# EAGLE design i2c_encoder_6 (EAGLE 9.3.0)

## Sheet 1 of 8
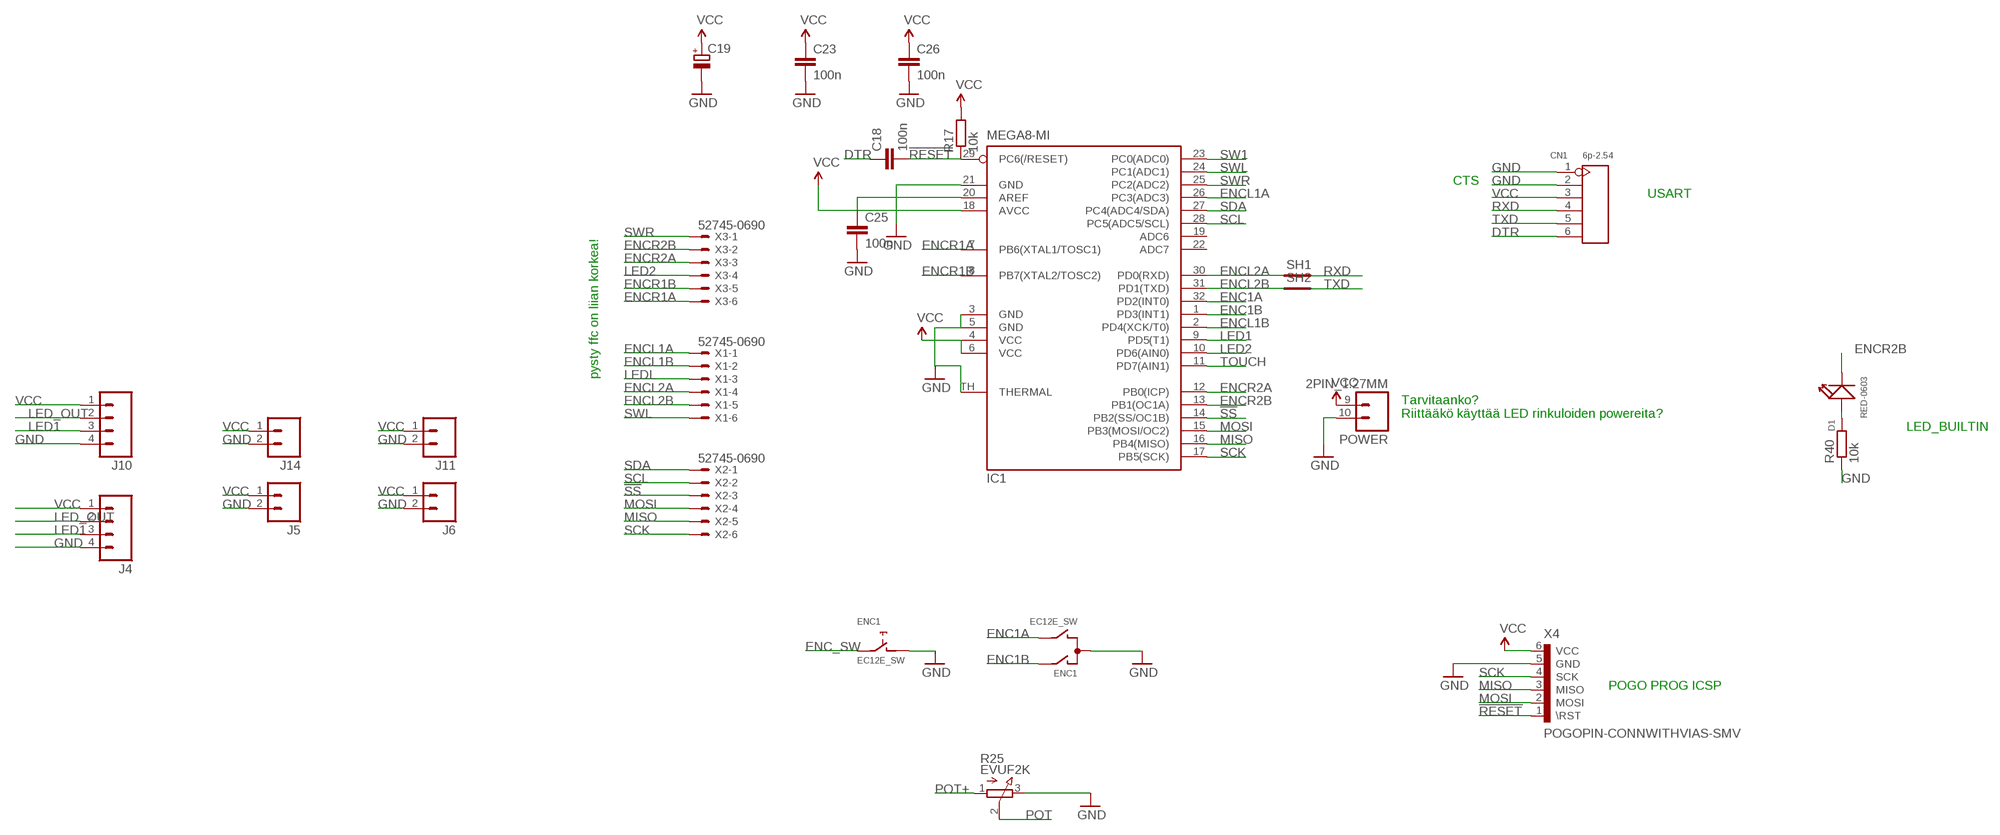
[diagram p0: schematic, sheet 1]

### Parts
C18  100n  CAP0603-CAP  [0603-CAP]
C19  CPOL-EUC  [PANASONIC_C]
C23  100n  CAP0603-CAP  [0603-CAP]
C25  100n  CAP0603-CAP  [0603-CAP]
C26  100n  CAP0603-CAP  [0603-CAP]
CN1  6p-2.54  DIP-BLACK-FEMALE-HEADER-VERT(6P-2.54)  [H6-2.54]
D1  RED-0603  LED-SMD-RED-DIFFUSED(0603)  [LED-0603]
ENC1  EC12E_SW  [ALPS_EC12E_SW]
IC1  MEGA8-MI  [MLF32-TH]
J4  M04NO_SILK_ALL_ROUND  [1X04_NO_SILK_ALL_ROUND]
J5  M021X02_NO_SILK  [1X02_NO_SILK]
J6  M021X02_NO_SILK  [1X02_NO_SILK]
J10  M04NO_SILK_ALL_ROUND  [1X04_NO_SILK_ALL_ROUND]
J11  M021X02_NO_SILK  [1X02_NO_SILK]
J14  M021X02_NO_SILK  [1X02_NO_SILK]
POWER  2PIN_1.27MM  [1X02_1.27MM_NO_SILK]
R17  10k  R-EU_R0603  [R0603]
R25  EVUF2K  [EVUFXK]
R40  10k  R-EU_R0603  [R0603]
SH1  SHORT  [SHORT_TOP_8MIL]
SH2  SHORT  [SHORT_TOP_8MIL]
X1  52745-0690  [52745-0690]
X2  52745-0690  [52745-0690]
X3  52745-0690  [52745-0690]
X4  POGOPIN-CONNWITHVIAS-SMV  [POGOPROG-CONN-OH-SMALLERVIAS]

### Nets
!RESET: C18.2 IC1.29(PC6(/RESET)) R17.1 X4.1(\RST)
!SS: IC1.14(PB2(SS/OC1B)) X2.3 ; also sheet 7
AREF: C25.1 IC1.20(AREF)
DTR: C18.1 CN1.6
ENC1A: ENC1.B IC1.32(PD2(INT0)) ; also sheet 4,8
ENC1B: ENC1.A IC1.1(PD3(INT1)) ; also sheet 4,8
ENC_SW: ENC1.E ; also sheet 4,8
ENCL1A: IC1.26(PC3(ADC3)) X1.1 ; also sheet 4
ENCL1B: IC1.2(PD4(XCK/T0)) X1.2 ; also sheet 4
ENCL2A: IC1.30(PD0(RXD)) SH1.P$1 X1.4 ; also sheet 4
ENCL2B: IC1.31(PD1(TXD)) SH2.P$1 X1.5 ; also sheet 4
ENCR1A: IC1.7(PB6(XTAL1/TOSC1)) X3.6 ; also sheet 4
ENCR1B: IC1.8(PB7(XTAL2/TOSC2)) X3.5 ; also sheet 4
ENCR2A: IC1.12(PB0(ICP)) X3.3 ; also sheet 4
ENCR2B: D1.- IC1.13(PB1(OC1A)) X3.2 ; also sheet 4
GND: C19.- C23.2 C25.2 C26.2 CN1.1 CN1.2 ENC1.C ENC1.D IC1.3(GND) IC1.5(GND) IC1.21(GND) IC1.TH(THERMAL) J4.4 J5.2 J6.2 J10.4 J11.2 J14.2 POWER.10 R25.3(E) R40.1 X4.5(GND) ; also sheet 2,3,5,6,7,8
LED1: IC1.9(PD5(T1)) J4.3 J10.3 ; also sheet 4,5,6,8
LED2: IC1.10(PD6(AIN0)) X3.4 ; also sheet 4
LED_OUT: J4.2 J10.2 ; also sheet 4,5,6,8
LEDL: X1.3 ; also sheet 4
MISO: IC1.16(PB4(MISO)) X2.5 X4.3(MISO) ; also sheet 2,7
MOSI: IC1.15(PB3(MOSI/OC2)) X2.4 X4.2(MOSI) ; also sheet 2,7
N$31: D1.+ R40.2
POT: R25.2(S) ; also sheet 4,8
POT+: R25.1(A) ; also sheet 4
RXD: CN1.4 SH1.P$2
SCK: IC1.17(PB5(SCK)) X2.6 X4.4(SCK) ; also sheet 2,7
SCL: IC1.28(PC5(ADC5/SCL)) X2.2 ; also sheet 7
SDA: IC1.27(PC4(ADC4/SDA)) X2.1 ; also sheet 7
SW1: IC1.23(PC0(ADC0)) ; also sheet 4
SWL: IC1.24(PC1(ADC1)) X1.6 ; also sheet 4
SWR: IC1.25(PC2(ADC2)) X3.1 ; also sheet 4
TOUCH: IC1.11(PD7(AIN1)) ; also sheet 3,4
TXD: CN1.5 SH2.P$2
VCC: C19.+ C23.1 C26.1 CN1.3 IC1.4(VCC) IC1.6(VCC) IC1.18(AVCC) J4.1 J5.1 J6.1 J10.1 J11.1 J14.1 POWER.9 R17.2 X4.6(VCC) ; also sheet 3,4,5,6,7,8
Unconnected: ENC1.GND1(G) ENC1.GND2(G) IC1.19(ADC6) IC1.22(ADC7)

### Notes on the sheet
- CTS
- USART
- pysty ffc on liian korkea!
- Tarvitaanko?
  Riittääkö käyttää LED rinkuloiden powereita?
- LED_BUILTIN
- POGO PROG ICSP

## Sheet 2 of 8
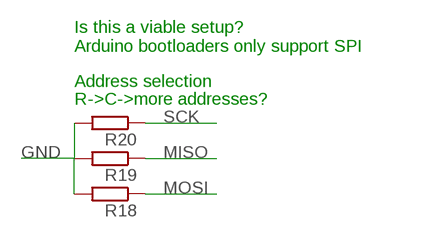
[diagram p1: schematic, sheet 2]

### Parts
R18  R-EU_R0603  [R0603]
R19  R-EU_R0603  [R0603]
R20  R-EU_R0603  [R0603]

### Nets
GND: R18.2 R19.2 R20.2 ; also sheet 1,3,5,6,7,8
MISO: R19.1 ; also sheet 1,7
MOSI: R18.1 ; also sheet 1,7
SCK: R20.1 ; also sheet 1,7

### Notes on the sheet
- Is this a viable setup?
  Arduino bootloaders only support SPI
- Address selection
- R->C->more addresses?

## Sheet 3 of 8
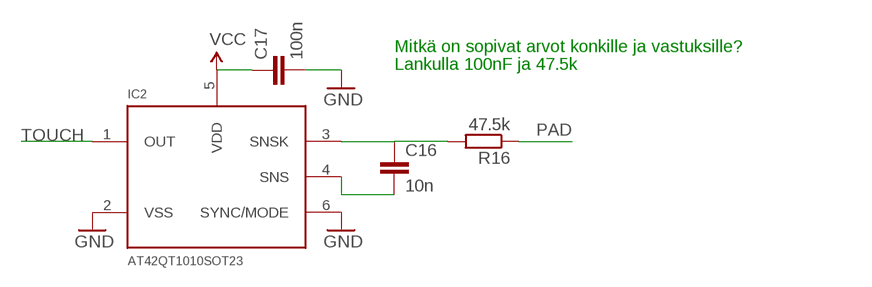
[diagram p2: schematic, sheet 3]

### Parts
C16  10n  CAP0603-CAP  [0603-CAP]
C17  100n  CAP0603-CAP  [0603-CAP]
IC2  AT42QT1010SOT23  [SOT23-6]
R16  47.5k  R-EU_R0603  [R0603]

### Nets
GND: C17.2 IC2.2(VSS) IC2.6(SYNC/MODE) ; also sheet 1,2,5,6,7,8
N$7: C16.1 IC2.3(SNSK) R16.2
N$15: C16.2 IC2.4(SNS)
PAD: R16.1
TOUCH: IC2.1(OUT) ; also sheet 1,4
VCC: C17.1 IC2.5(VDD) ; also sheet 1,4,5,6,7,8

### Notes on the sheet
- Mitkä on sopivat arvot konkille ja vastuksille?
- Lankulla 100nF ja 47.5k

## Sheet 4 of 8
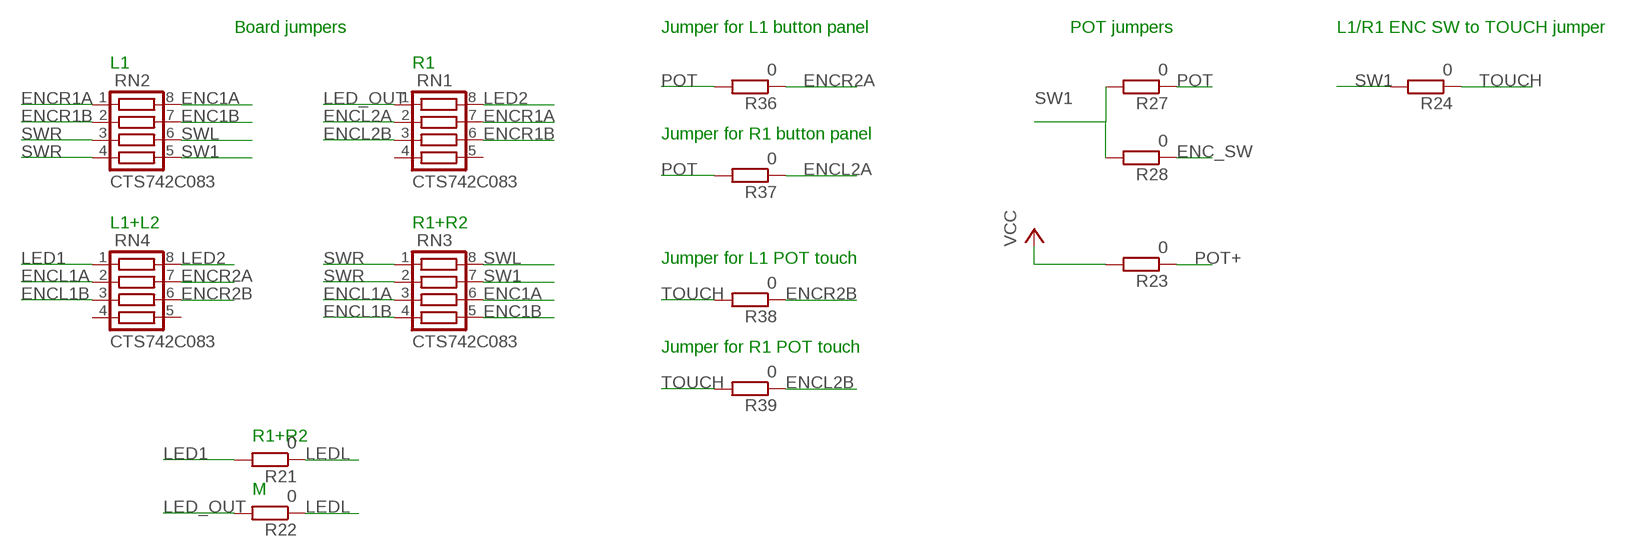
[diagram p3: schematic, sheet 4]

### Parts
R21  0  R-EU_R0603  [R0603]
R22  0  R-EU_R0603  [R0603]
R23  0  R-EU_R0603  [R0603]
R24  0  R-EU_R0603  [R0603]
R27  0  R-EU_R0603  [R0603]
R28  0  R-EU_R0603  [R0603]
R36  0  R-EU_R0603  [R0603]
R37  0  R-EU_R0603  [R0603]
R38  0  R-EU_R0603  [R0603]
R39  0  R-EU_R0603  [R0603]
RN1  CTS742C083  [CTS742C083]
RN2  CTS742C083  [CTS742C083]
RN3  CTS742C083  [CTS742C083]
RN4  CTS742C083  [CTS742C083]

### Nets
ENC1A: RN2.8 RN3.6 ; also sheet 1,8
ENC1B: RN2.7 RN3.5 ; also sheet 1,8
ENC_SW: R28.1 ; also sheet 1,8
ENCL1A: RN3.3 RN4.2 ; also sheet 1
ENCL1B: RN3.4 RN4.3 ; also sheet 1
ENCL2A: R37.1 RN1.2 ; also sheet 1
ENCL2B: R39.1 RN1.3 ; also sheet 1
ENCR1A: RN1.7 RN2.1 ; also sheet 1
ENCR1B: RN1.6 RN2.2 ; also sheet 1
ENCR2A: R36.1 RN4.7 ; also sheet 1
ENCR2B: R38.1 RN4.6 ; also sheet 1
LED1: R21.2 RN4.1 ; also sheet 1,5,6,8
LED2: RN1.8 RN4.8 ; also sheet 1
LED_OUT: R22.2 RN1.1 ; also sheet 1,5,6,8
LEDL: R21.1 R22.1 ; also sheet 1
POT: R27.1 R36.2 R37.2 ; also sheet 1,8
POT+: R23.1 ; also sheet 1
SW1: R24.2 R27.2 R28.2 RN2.5 RN3.7 ; also sheet 1
SWL: RN2.6 RN3.8 ; also sheet 1
SWR: RN2.3 RN2.4 RN3.1 RN3.2 ; also sheet 1
TOUCH: R24.1 R38.2 R39.2 ; also sheet 1,3
VCC: R23.2 ; also sheet 1,3,5,6,7,8
Unconnected: RN1.4 RN1.5 RN4.4 RN4.5

### Notes on the sheet
- Board jumpers | Jumper for L1 button panel | POT jumpers | L1/R1 ENC SW to TOUCH jumper
- L1 | R1
- Jumper for R1 button panel
- L1+L2 | R1+R2
- Jumper for L1 POT touch
- Jumper for R1 POT touch
- R1+R2
- M

## Sheet 5 of 8
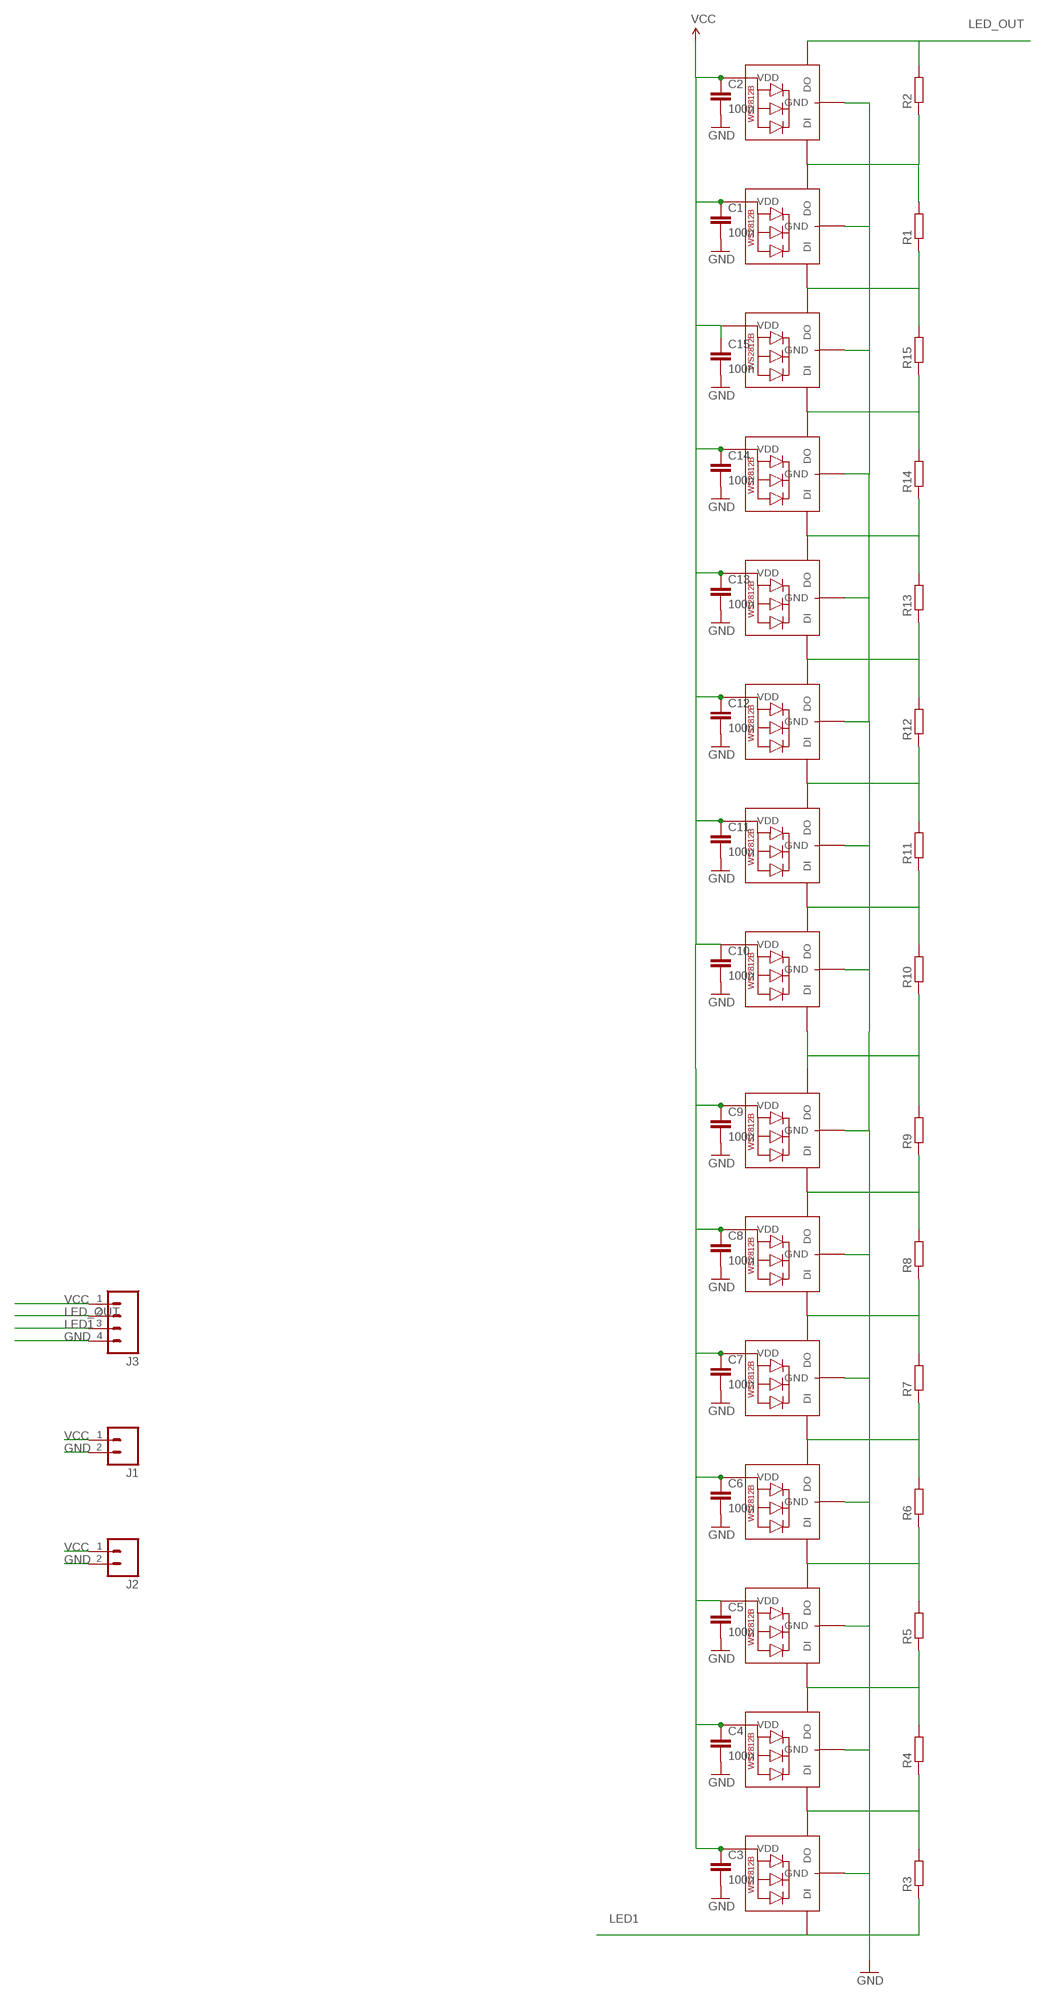
[diagram p4: schematic, sheet 5]

### Parts
C1  100n  CAP0603-CAP  [0603-CAP]
C2  100n  CAP0603-CAP  [0603-CAP]
C3  100n  CAP0603-CAP  [0603-CAP]
C4  100n  CAP0603-CAP  [0603-CAP]
C5  100n  CAP0603-CAP  [0603-CAP]
C6  100n  CAP0603-CAP  [0603-CAP]
C7  100n  CAP0603-CAP  [0603-CAP]
C8  100n  CAP0603-CAP  [0603-CAP]
C9  100n  CAP0603-CAP  [0603-CAP]
C10  100n  CAP0603-CAP  [0603-CAP]
C11  100n  CAP0603-CAP  [0603-CAP]
C12  100n  CAP0603-CAP  [0603-CAP]
C13  100n  CAP0603-CAP  [0603-CAP]
C14  100n  CAP0603-CAP  [0603-CAP]
C15  100n  CAP0603-CAP  [0603-CAP]
J1  M021X02_NO_SILK  [1X02_NO_SILK]
J2  M021X02_NO_SILK  [1X02_NO_SILK]
J3  M04NO_SILK_ALL_ROUND  [1X04_NO_SILK_ALL_ROUND]
LED1  WS2812B3535  [LED3535]
LED2  WS2812B3535  [LED3535]
LED3  WS2812B3535  [LED3535]
LED4  WS2812B3535  [LED3535]
LED5  WS2812B3535  [LED3535]
LED6  WS2812B3535  [LED3535]
LED7  WS2812B3535  [LED3535]
LED8  WS2812B3535  [LED3535]
LED9  WS2812B3535  [LED3535]
LED10  WS2812B3535  [LED3535]
LED11  WS2812B3535  [LED3535]
LED12  WS2812B3535  [LED3535]
LED13  WS2812B3535  [LED3535]
LED14  WS2812B3535  [LED3535]
LED15  WS2812B3535  [LED3535]
R1  R-EU_R0603  [R0603]
R2  R-EU_R0603  [R0603]
R3  R-EU_R0603  [R0603]
R4  R-EU_R0603  [R0603]
R5  R-EU_R0603  [R0603]
R6  R-EU_R0603  [R0603]
R7  R-EU_R0603  [R0603]
R8  R-EU_R0603  [R0603]
R9  R-EU_R0603  [R0603]
R10  R-EU_R0603  [R0603]
R11  R-EU_R0603  [R0603]
R12  R-EU_R0603  [R0603]
R13  R-EU_R0603  [R0603]
R14  R-EU_R0603  [R0603]
R15  R-EU_R0603  [R0603]

### Nets
GND: C1.2 C2.2 C3.2 C4.2 C5.2 C6.2 C7.2 C8.2 C9.2 C10.2 C11.2 C12.2 C13.2 C14.2 C15.2 J1.2 J2.2 J3.4 LED1.4(GND) LED2.4(GND) LED3.4(GND) LED4.4(GND) LED5.4(GND) LED6.4(GND) LED7.4(GND) LED8.4(GND) LED9.4(GND) LED10.4(GND) LED11.4(GND) LED12.4(GND) LED13.4(GND) LED14.4(GND) LED15.4(GND) ; also sheet 1,2,3,6,7,8
LED1: J3.3 LED1.1(DI) R3.1 ; also sheet 1,4,6,8
LED_OUT: J3.2 LED15.3(DO) R2.2 ; also sheet 1,4,6,8
N$1: LED10.3(DO) LED11.1(DI) R12.2 R13.1
N$2: LED11.3(DO) LED12.1(DI) R13.2 R14.1
N$5: LED2.3(DO) LED3.1(DI) R4.2 R5.1
N$6: LED13.3(DO) LED14.1(DI) R1.1 R15.2
N$9: LED12.3(DO) LED13.1(DI) R14.2 R15.1
N$10: LED8.3(DO) LED9.1(DI) R10.2 R11.1
N$11: LED3.3(DO) LED4.1(DI) R5.2 R6.1
N$12: LED14.3(DO) LED15.1(DI) R1.2 R2.1
N$14: LED1.3(DO) LED2.1(DI) R3.2 R4.1
N$17: LED4.3(DO) LED5.1(DI) R6.2 R7.1
N$18: LED5.3(DO) LED6.1(DI) R7.2 R8.1
N$19: LED6.3(DO) LED7.1(DI) R8.2 R9.1
N$22: LED9.3(DO) LED10.1(DI) R11.2 R12.1
N$27: LED7.3(DO) LED8.1(DI) R9.2 R10.1
VCC: C1.1 C2.1 C3.1 C4.1 C5.1 C6.1 C7.1 C8.1 C9.1 C10.1 C11.1 C12.1 C13.1 C14.1 C15.1 J1.1 J2.1 J3.1 LED1.2(VDD) LED2.2(VDD) LED3.2(VDD) LED4.2(VDD) LED5.2(VDD) LED6.2(VDD) LED7.2(VDD) LED8.2(VDD) LED9.2(VDD) LED10.2(VDD) LED11.2(VDD) LED12.2(VDD) LED13.2(VDD) LED14.2(VDD) LED15.2(VDD) ; also sheet 1,3,4,6,7,8

## Sheet 6 of 8
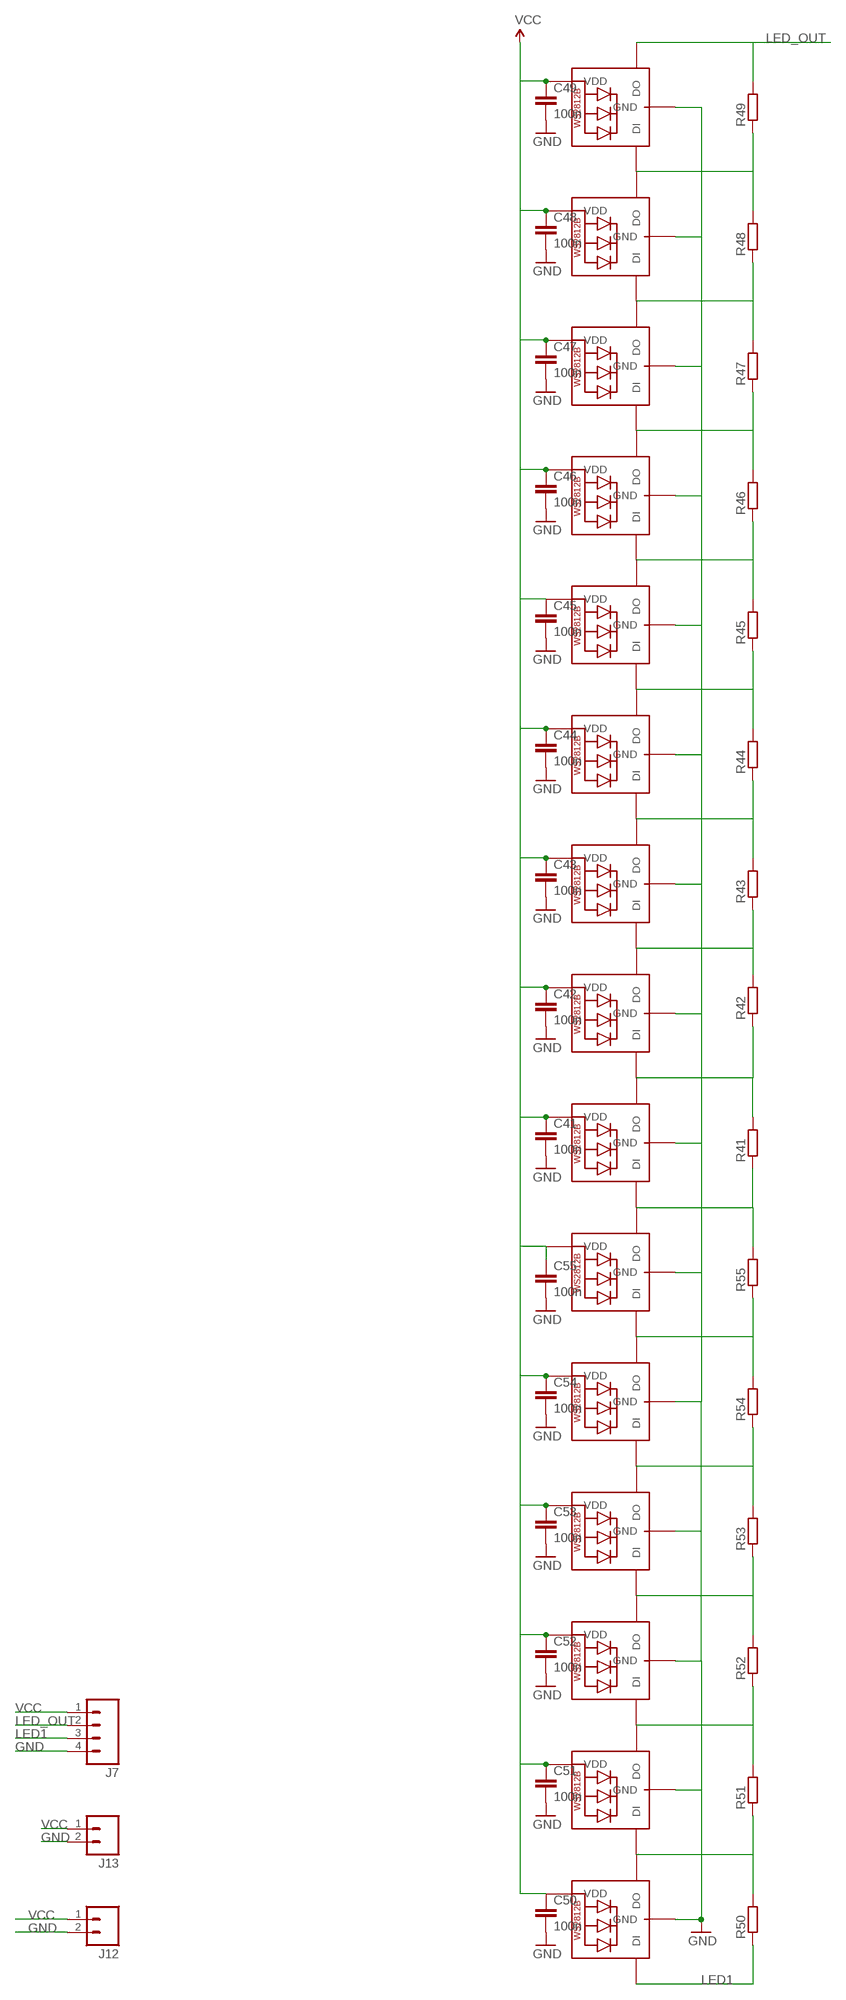
[diagram p5: schematic, sheet 6]

### Parts
C41  100n  CAP0603-CAP  [0603-CAP]
C42  100n  CAP0603-CAP  [0603-CAP]
C43  100n  CAP0603-CAP  [0603-CAP]
C44  100n  CAP0603-CAP  [0603-CAP]
C45  100n  CAP0603-CAP  [0603-CAP]
C46  100n  CAP0603-CAP  [0603-CAP]
C47  100n  CAP0603-CAP  [0603-CAP]
C48  100n  CAP0603-CAP  [0603-CAP]
C49  100n  CAP0603-CAP  [0603-CAP]
C50  100n  CAP0603-CAP  [0603-CAP]
C51  100n  CAP0603-CAP  [0603-CAP]
C52  100n  CAP0603-CAP  [0603-CAP]
C53  100n  CAP0603-CAP  [0603-CAP]
C54  100n  CAP0603-CAP  [0603-CAP]
C55  100n  CAP0603-CAP  [0603-CAP]
J7  M04NO_SILK_ALL_ROUND  [1X04_NO_SILK_ALL_ROUND]
J12  M021X02_NO_SILK  [1X02_NO_SILK]
J13  M021X02_NO_SILK  [1X02_NO_SILK]
LED31  WS2812B3535  [LED3535]
LED32  WS2812B3535  [LED3535]
LED33  WS2812B3535  [LED3535]
LED34  WS2812B3535  [LED3535]
LED35  WS2812B3535  [LED3535]
LED36  WS2812B3535  [LED3535]
LED37  WS2812B3535  [LED3535]
LED38  WS2812B3535  [LED3535]
LED39  WS2812B3535  [LED3535]
LED40  WS2812B3535  [LED3535]
LED41  WS2812B3535  [LED3535]
LED42  WS2812B3535  [LED3535]
LED43  WS2812B3535  [LED3535]
LED44  WS2812B3535  [LED3535]
LED45  WS2812B3535  [LED3535]
R41  R-EU_R0603  [R0603]
R42  R-EU_R0603  [R0603]
R43  R-EU_R0603  [R0603]
R44  R-EU_R0603  [R0603]
R45  R-EU_R0603  [R0603]
R46  R-EU_R0603  [R0603]
R47  R-EU_R0603  [R0603]
R48  R-EU_R0603  [R0603]
R49  R-EU_R0603  [R0603]
R50  R-EU_R0603  [R0603]
R51  R-EU_R0603  [R0603]
R52  R-EU_R0603  [R0603]
R53  R-EU_R0603  [R0603]
R54  R-EU_R0603  [R0603]
R55  R-EU_R0603  [R0603]

### Nets
GND: C41.2 C42.2 C43.2 C44.2 C45.2 C46.2 C47.2 C48.2 C49.2 C50.2 C51.2 C52.2 C53.2 C54.2 C55.2 J7.4 J12.2 J13.2 LED31.4(GND) LED32.4(GND) LED33.4(GND) LED34.4(GND) LED35.4(GND) LED36.4(GND) LED37.4(GND) LED38.4(GND) LED39.4(GND) LED40.4(GND) LED41.4(GND) LED42.4(GND) LED43.4(GND) LED44.4(GND) LED45.4(GND) ; also sheet 1,2,3,5,7,8
LED1: J7.3 LED31.1(DI) R50.1 ; also sheet 1,4,5,8
LED_OUT: J7.2 LED45.3(DO) R49.2 ; also sheet 1,4,5,8
N$3: LED37.3(DO) LED38.1(DI) R41.2 R42.1
N$4: LED38.3(DO) LED39.1(DI) R42.2 R43.1
N$8: LED39.3(DO) LED40.1(DI) R43.2 R44.1
N$16: LED42.3(DO) LED43.1(DI) R46.2 R47.1
N$20: LED43.3(DO) LED44.1(DI) R47.2 R48.1
N$21: LED44.3(DO) LED45.1(DI) R48.2 R49.1
N$23: LED32.3(DO) LED33.1(DI) R51.2 R52.1
N$24: LED33.3(DO) LED34.1(DI) R52.2 R53.1
N$25: LED34.3(DO) LED35.1(DI) R53.2 R54.1
N$26: LED35.3(DO) LED36.1(DI) R54.2 R55.1
N$28: LED31.3(DO) LED32.1(DI) R50.2 R51.1
N$29: LED40.3(DO) LED41.1(DI) R44.2 R45.1
N$30: LED41.3(DO) LED42.1(DI) R45.2 R46.1
N$46: LED36.3(DO) LED37.1(DI) R41.1 R55.2
VCC: C41.1 C42.1 C43.1 C44.1 C45.1 C46.1 C47.1 C48.1 C49.1 C50.1 C51.1 C52.1 C53.1 C54.1 C55.1 J7.1 J12.1 J13.1 LED31.2(VDD) LED32.2(VDD) LED33.2(VDD) LED34.2(VDD) LED35.2(VDD) LED36.2(VDD) LED37.2(VDD) LED38.2(VDD) LED39.2(VDD) LED40.2(VDD) LED41.2(VDD) LED42.2(VDD) LED43.2(VDD) LED44.2(VDD) LED45.2(VDD) ; also sheet 1,3,4,5,7,8

## Sheet 7 of 8
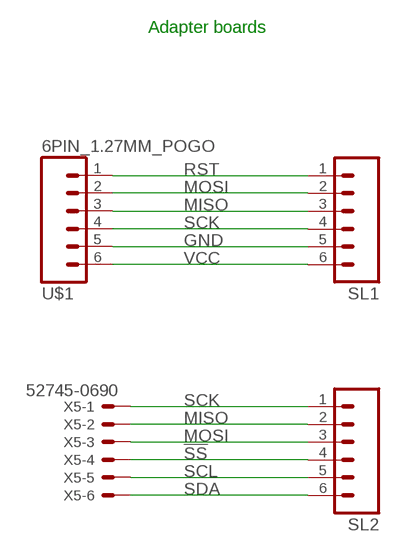
[diagram p6: schematic, sheet 7]

### Parts
SL1  M06  [06P]
SL2  M06  [06P]
U$1  6PIN_1.27MM_POGO  [1X06-1.27MM_POGO]
X5  52745-0690  [52745-0690]

### Nets
!SS: SL2.4 X5.4 ; also sheet 1
GND: SL1.5 U$1.5 ; also sheet 1,2,3,5,6,8
MISO: SL1.3 SL2.2 U$1.3 X5.2 ; also sheet 1,2
MOSI: SL1.2 SL2.3 U$1.2 X5.3 ; also sheet 1,2
RST: SL1.1 U$1.1
SCK: SL1.4 SL2.1 U$1.4 X5.1 ; also sheet 1,2
SCL: SL2.5 X5.5 ; also sheet 1
SDA: SL2.6 X5.6 ; also sheet 1
VCC: SL1.6 U$1.6 ; also sheet 1,3,4,5,6,8

### Notes on the sheet
- Adapter boards

## Sheet 8 of 8
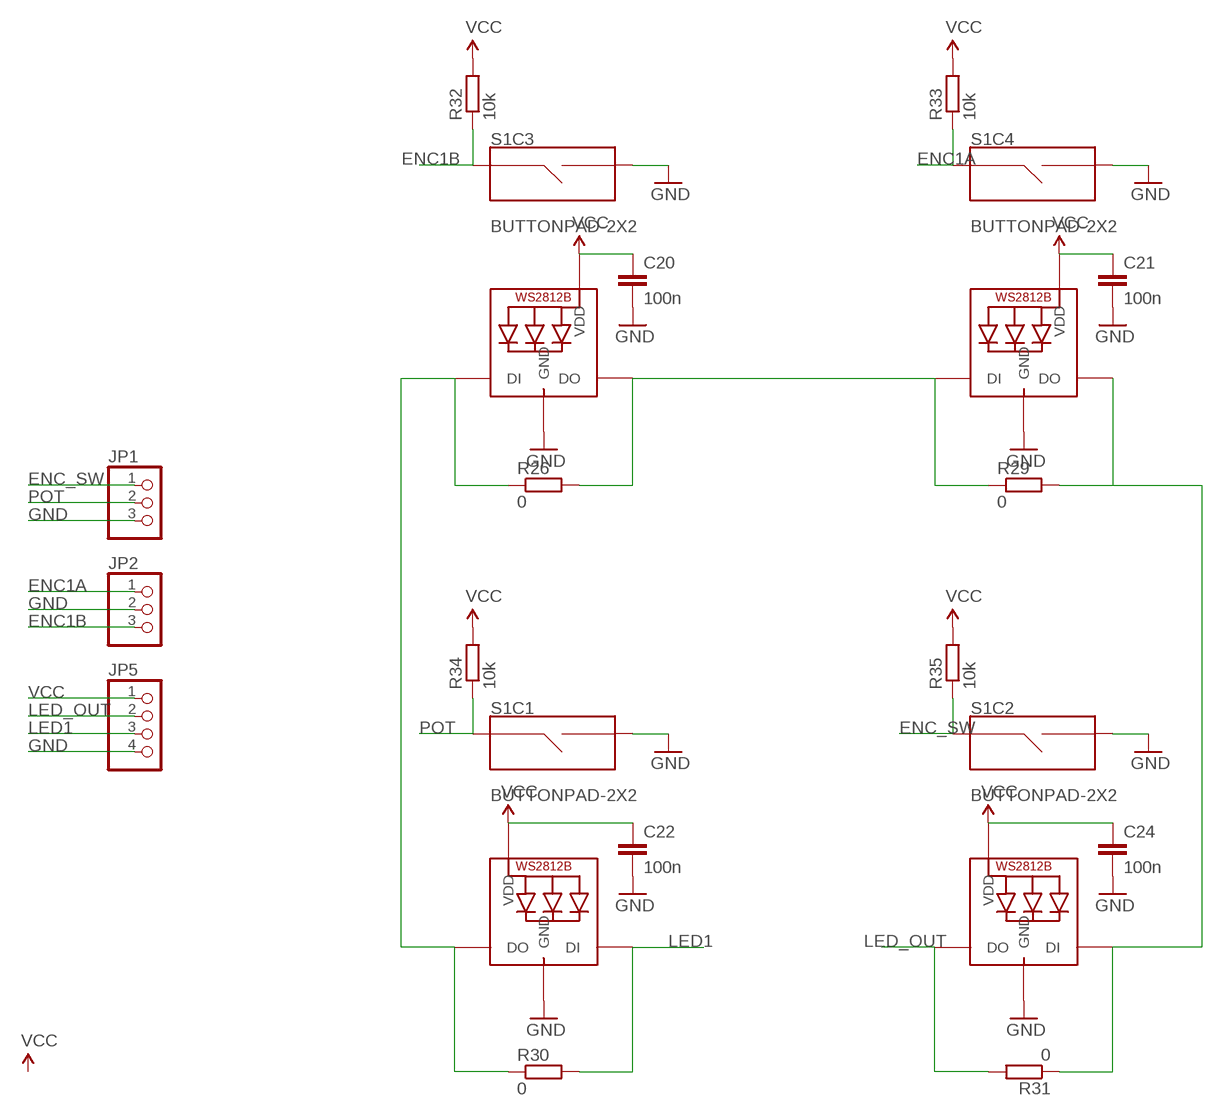
[diagram p7: schematic, sheet 8]

### Parts
C20  100n  CAP0603-CAP  [0603-CAP]
C21  100n  CAP0603-CAP  [0603-CAP]
C22  100n  CAP0603-CAP  [0603-CAP]
C24  100n  CAP0603-CAP  [0603-CAP]
JP1  PINHD-1X31X03_SMT  [1X03_SMT]
JP2  PINHD-1X31X03_SMT  [1X03_SMT]
JP5  PINHD-1X41X04_SMT  [1X04_SMT]
LED16  WS2812B3535  [LED3535]
LED17  WS2812B3535  [LED3535]
LED18  WS2812B3535  [LED3535]
LED19  WS2812B3535  [LED3535]
R26  0  R-EU_R0603  [R0603]
R29  0  R-EU_R0603  [R0603]
R30  0  R-EU_R0603  [R0603]
R31  0  R-EU_R0603  [R0603]
R32  10k  R-EU_R0603  [R0603]
R33  10k  R-EU_R0603  [R0603]
R34  10k  R-EU_R0603  [R0603]
R35  10k  R-EU_R0603  [R0603]
S1  BUTTONPAD-2X2  [BUTTONPAD-2X2-SINGLE]

### Nets
ENC1A: JP2.1 R33.1 S1.SIG7(C4:SIG1) ; also sheet 1,4
ENC1B: JP2.3 R32.1 S1.SIG5(C3:SIG1) ; also sheet 1,4
ENC_SW: JP1.1 R35.1 S1.SIG3(C2:SIG1) ; also sheet 1,4
GND: C20.2 C21.2 C22.2 C24.2 JP1.3 JP2.2 JP5.4 LED16.4(GND) LED17.4(GND) LED18.4(GND) LED19.4(GND) S1.SIG2(C1:SIG2) S1.SIG4(C2:SIG2) S1.SIG6(C3:SIG2) S1.SIG8(C4:SIG2) ; also sheet 1,2,3,5,6,7
LED1: JP5.3 LED16.1(DI) R30.2 ; also sheet 1,4,5,6
LED_OUT: JP5.2 LED17.3(DO) R31.2 ; also sheet 1,4,5,6
N$13: LED16.3(DO) LED18.1(DI) R26.1 R30.1
N$43: LED17.1(DI) LED19.3(DO) R29.2 R31.1
N$44: LED18.3(DO) LED19.1(DI) R26.2 R29.1
POT: JP1.2 R34.1 S1.SIG1(C1:SIG1) ; also sheet 1,4
VCC: C20.1 C21.1 C22.1 C24.1 JP5.1 LED16.2(VDD) LED17.2(VDD) LED18.2(VDD) LED19.2(VDD) R32.2 R33.2 R34.2 R35.2 ; also sheet 1,3,4,5,6,7

## Library data of the parts
C1-C18 C20-C26 C41-C55 = SparkFun-Capacitors:CAP: Capacitor Standard 0603 ceramic capacitor, and 0.1" leaded capacitor.
C19 = rcl:CPOL-EU: POLARIZED CAPACITOR, European symbol; SPICEPREFIX: C
CN1 = i2c_encoder:DIP-BLACK-FEMALE-HEADER-VERT(6P-2.54): 320030060; MPN: F185-1106A1BSYC1
D1 = Seeed-LED-2016:LED-SMD-RED-DIFFUSED(0603): 304090042; MPN: 19-217-R6C-AL1M2VY-3T
ENC1 = switch_pec:EC12E_SW: ALPS rotary Encoder EC12E series with switch; MPN: EC12E2424407; OC_FARNELL: 1520813; OC_NEWARK: 74M1068
IC1 = atmel:MEGA8-MI: MICROCONTROLLER 8 Kbytes FLASH, 1 kbytes SRAM, 512 bytes EEPROM, USART, 6-channel 10 bit ADC, 2-channel 8 bit ADC Pin compatible with Atmega48, ATMega88, ATMega168 Source: avr.lbr; MPN: ATMEGA88PA-MU; OC_FARNELL: 1715491; OC_NEWARK: 15R0272
IC2 = touch_sensor:AT42QT1010: Atmel AT42QT1010 The AT42QT1010 (QT1010) is a digital burst mode charge-transfer (QT™) sensor that is capable of detecting nearproximityor touch, making it ideal for implementing touch controls.The QT1010 is designed specifically for human interfaces, like control panels, appliances, toys, lighting controls, or anywhere a mechanical switch or button may be found. It includes all hardware and signal processing functions necessary to provide stable sensing under a wide variety of changing conditions. Only a single low-cost capacitor is required for operation. This chip is identical to the AT42QT1011, however the capsense times out after 60 seconds. Reciprocally, the capsense on the 1011 never times out. Reference "Signal Processing" in the datasheet. Datasheet <http://www.atmel.com/images/Atmel-9541-AT42-QTouch-BSW-AT42QT1010_Datasheet.pdf> Sparkfun Products Sparkfun Capacitive Touch Breakout <https://www.sparkfun.com/products/12041> (SEN-12041)
J1 J2 J5 J6 J11-J14 = i2c_encoder:M02: Standard 2-pin 0.1" header. Use with - straight break away headers ( PRT-00116) - right angle break away headers (PRT-00553) - swiss pins (PRT-00743) - machine pins (PRT-00117) - female headers (PRT-00115) Molex polarized connector foot print use with: PRT-08233 with associated crimp pins and housings. 2.54_SCREWTERM for use with PRT-10571. 3.5mm Screw Terminal footprints for PRT-08084 5mm Screw Terminal footprints for use with PRT-08432
J3 J4 J7 J10 = i2c_encoder:M04: Header 4 Standard 4-pin 0.1" header. Use with straight break away headers (SKU : PRT-00116), right angle break away headers (PRT-00553), swiss pins (PRT-00743), machine pins (PRT-00117), and female headers (PRT-00115). Molex polarized connector foot print use with SKU : PRT-08231 with associated crimp pins and housings. 1MM SMD Version SKU: PRT-10208; PROD_ID: CONN-09696
JP1 JP2 = pinhead_plus:PINHD-1X3: PIN HEADER
JP5 = pinhead_plus:PINHD-1X4: PIN HEADER
LED1-LED3 LED5-LED19 LED31-LED45 = i2c_encoder:WS2812B
LED4 = i2c_encoder:WS2812B; SPICEPREFIX: E
POWER = edge:2PIN_1.27MM
R1-R21 R26 R29-R35 R40-R55 = rcl:R-EU_: RESISTOR, European symbol
R22-R24 R27 R28 R36-R39 = rcl:R-EU_: RESISTOR, European symbol; SPICEPREFIX: R
R25 = i2c_encoder:EVU: Potentiometer modified from "9 mm Square Rotary Potentiometers (Source: Panasonic)"
RN1-RN4 = resistor-net:CTS742C083: Chip Resistor Array 4 Single Resistor Source: http://www.ctscorp.com/components/Datasheets/CTSChipArrayDs.pdf; OC_FARNELL: unknown; OC_NEWARK: unknown
S1 = i2c_encoder:BUTTONPAD-2X2: 2x2 Button Pad w/ Single LEDs Layout and schematic for 2x2 button pad with single-color LEDs under each button. For use with the Button Pad 2x2 - LED Compatible <https://www.sparkfun.com/products/7836> and Button Pad 2x2 Top Bezel <https://www.sparkfun.com/products/8746>. Any single-color 5mm LED <https://www.sparkfun.com/categories/172> should be compatible. SparkFun Products SparkFun Simon Says - Through-Hole Soldering Kit <https://www.sparkfun.com/products/10547> (KIT-10547) Button Pad 2x2 - Breakout PCB <https://www.sparkfun.com/products/9277> (COM-09277); PROD_ID: COMP-08481; SF_SKU: COM-07836
SH1 SH2 = shorts:SHORT: Short between two nets
SL1 SL2 = con-amp-quick:M06: AMP QUICK CONNECTOR; OC_FARNELL: unknown; OC_NEWARK: unknown
U$1 = i2c_encoder:6PIN_1.27MM_POGO
X1-X3 X5 = i2c_encoder:52745-0690: FFC/FPC-to-Board 0.50mm (.020") SMT Top Contact Right Angle, ZIF, Style Receptacle 52745 / 52435 Source: http://www.molex.com/product/ffc/52745.html; MF: MOLEX; MPN: 52745-0690; OC_FARNELL: unknown; OC_NEWARK: 92M6374
X4 = Protofusion:POGOPIN-CONN: Protofusion custom pogo pin programming header

## Board
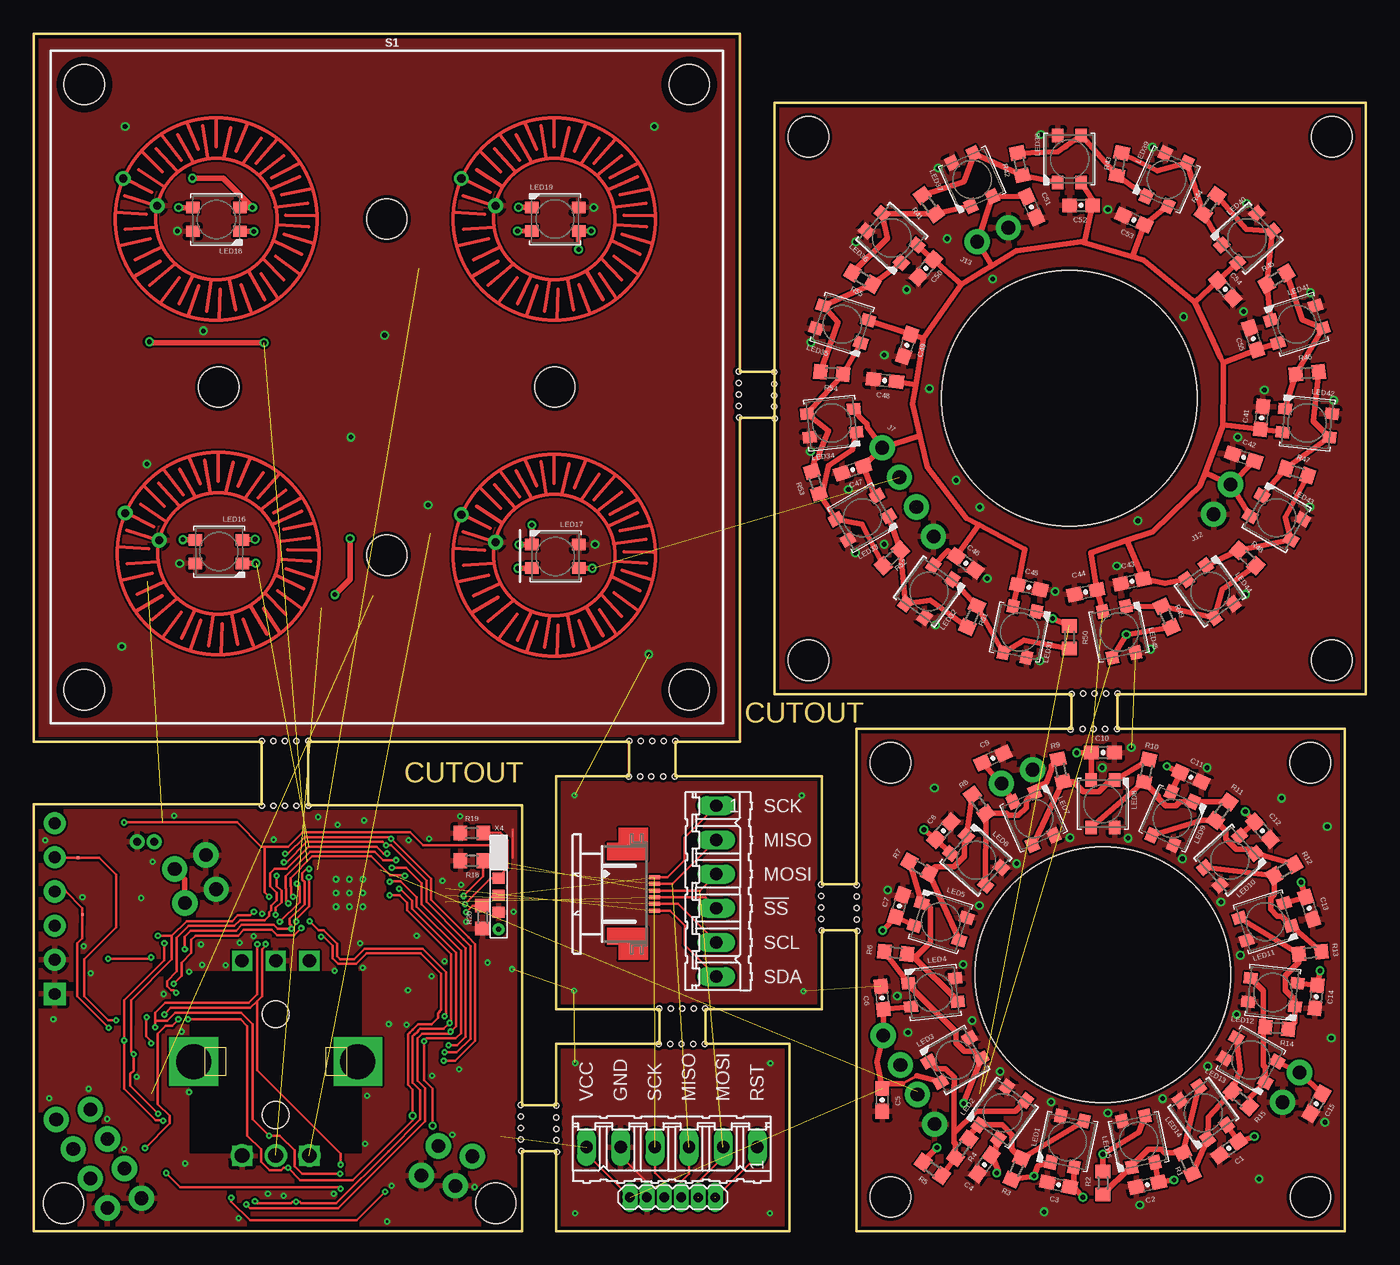
[diagram p8: board, top side]
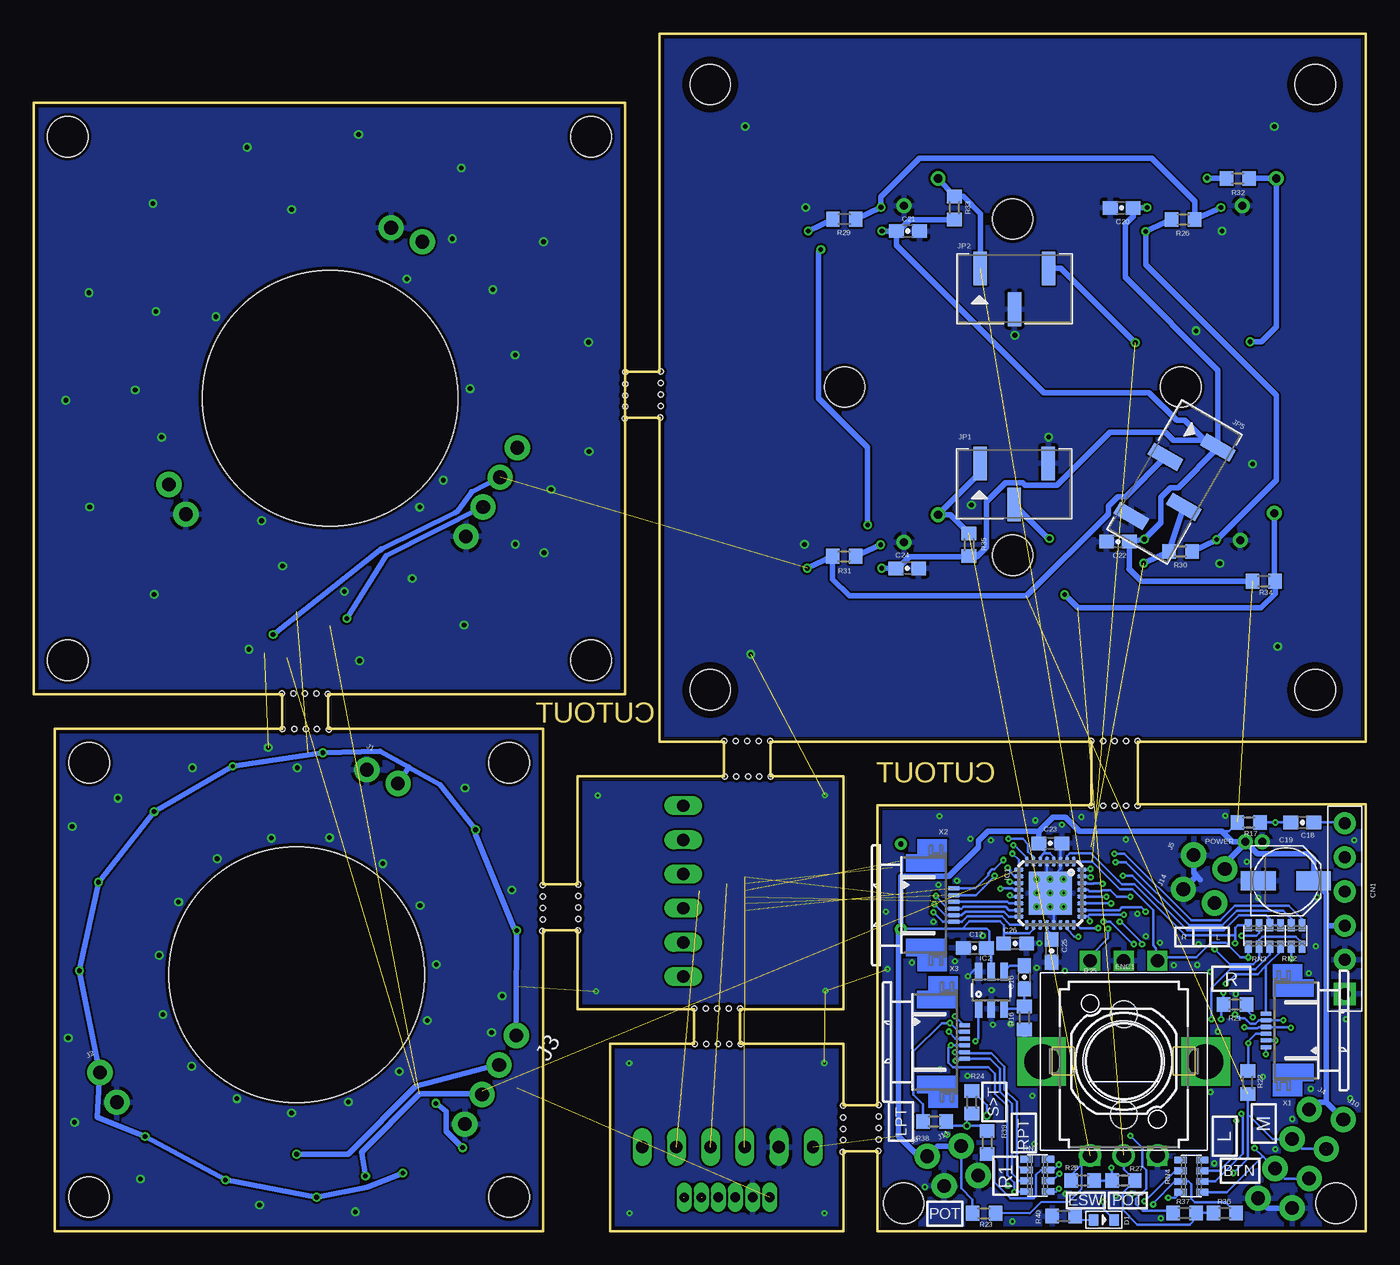
[diagram p9: board, bottom side, seen from below]

Size 99.09 x 89.03 mm. Coordinates in mm from the lower left corner, seen from the top.
Outline: 55.09,63.91 55.09,60.48
Outline: 55.09,60.48 55.09,39.9 77.19,39.9 77.19,37.36 61.19,37.36 61.19,25.78 58.65,25.78 58.65,33.83 47.73,33.83 47.73,36.37 52.55,36.37 52.55,60.48 55.09,60.48
Outline: 55.09,63.91 55.09,83.9 99.08,83.9 99.08,39.9 80.62,39.9 80.62,37.36 97.51,37.36 97.51,0 61.19,0 61.19,22.35 58.65,22.35 58.65,16.48 49.96,16.48 49.96,13.95 56.21,13.95 56.21,0 38.86,0 38.86,5.94 36.32,5.94 36.32,0 0,0 0,31.73 16.97,31.73 16.97,36.37 0,36.37 0,89.03 52.55,89.03 52.55,63.91 55.09,63.91
Outline: 36.32,31.67 20.42,31.67 20.42,36.37 44.3,36.37 44.3,33.83 38.86,33.83 38.86,16.48 46.53,16.48 46.53,13.95 38.86,13.95 38.86,9.37 36.32,9.37 36.32,31.67
Copper layers (1*16): Top 0.035mm / dielectric 1.5mm / Bottom 0.035mm
Design rules "SeeedStudio_2layer_DRU_no_angle_20140221": minimum track width 6mil, minimum drill 12mil, track to track 6mil, track to pad 6mil, pad to pad 6mil, via to via 6mil, smd to smd 0mil, copper to edge 10mil, drill to drill 10mil, minimum pad ring 10mil, minimum via ring 6mil, stop-mask expansion 2mil, vias tented up to drill 100mil, thermal gap 10mil
Holes 19 mm at 79.53,19.07 77.04,61.93
Holes 0.38 mm at 19.56,31.62 18.69,31.62 17.83,31.62 20.42,31.62 16.97,31.62 46.53,16.54 47.4,16.56 48.24,16.56 49.1,16.56 49.96,16.56 46.48,13.89 47.35,13.92 48.19,13.92 49.05,13.92 49.91,13.92 44.3,36.42 45.16,36.45 46,36.45 46.86,36.45 47.73,36.45 44.25,33.78 45.11,33.81 45.95,33.81 46.81,33.81 47.68,33.81 19.56,36.42 18.69,36.42 17.83,36.42 20.42,36.42 16.97,36.42 77.19,39.93 78.06,39.95 78.89,39.95 79.76,39.95 80.62,39.95 77.14,37.29 78,37.31 78.84,37.31 79.71,37.31 80.57,37.31 52.48,60.48 52.45,61.34 52.45,62.18 52.45,63.04 52.45,63.91 55.12,60.43 55.09,61.29 55.09,62.13 55.09,62.99 55.09,63.86 58.6,22.35 58.57,23.22 58.57,24.06 58.57,24.92 58.57,25.78 61.24,22.3 61.21,23.17 61.21,24 61.21,24.87 61.21,25.73 36.27,5.94 36.25,6.81 36.25,7.65 36.25,8.51 36.25,9.37 38.91,5.89 38.89,6.76 38.89,7.6 38.89,8.46 38.89,9.32
Holes 3 mm at 94.95,34.82 63.73,34.82 94.97,2.54 63.73,2.54 57.63,42.44 57.63,81.36 96.55,81.36 96.55,42.44 34.37,2.06 2.21,2.06
tRestrict: area 11.7,5.9 to 24.3,19.3
bRestrict: area 11.7,5.9 to 24.3,19.2

### Footprints (pad centres in the part's own frame; a part is rotated, then mirrored left to right if it is on the bottom)
0603-CAP = smd 1.1 x 1: 1 -0.85,0; 2 0.85,0
PANASONIC_C = smd 2.6 x 1.4: + 2.05,0; - -2.05,0
H6-2.54 = drill 0.889 pad 1.651 square: 1 0,6.35 | drill 0.889 pad 1.651: 2 0,3.81; 3 0,1.27; 4 0,-1.27; 5 0,-3.81; 6 0,-6.35
LED-0603 = smd 0.762 x 0.889: + -0.762,0; - 0.762,0
ALPS_EC12E_SW = drill 1 square: A -2.5,-7.5; B 2.5,-7.5; C 0,-7.5; D -2.5,7; E 2.5,7 | drill 2.6 square: GND1 -6.1,0; GND2 6.1,0
MLF32-TH = smd 0.7 x 0.3: 1 -2.35,1.75; 2 -2.35,1.25; 3 -2.35,0.75; 4 -2.35,0.25; 5 -2.35,-0.25; 6 -2.35,-0.75; 7 -2.35,-1.25; 8 -2.35,-1.75; 17 2.35,-1.75; 18 2.35,-1.25; 19 2.35,-0.75; 20 2.35,-0.25; 21 2.35,0.25; 22 2.35,0.75; 23 2.35,1.25; 24 2.35,1.75 | smd 0.3 x 0.7: 9 -1.75,-2.35; 10 -1.25,-2.35; 11 -0.75,-2.35; 12 -0.25,-2.35; 13 0.25,-2.35; 14 0.75,-2.35; 15 1.25,-2.35; 16 1.75,-2.35; 25 1.75,2.35; 26 1.25,2.35; 27 0.75,2.35; 28 0.25,2.35; 29 -0.25,2.35; 30 -0.75,2.35; 31 -1.25,2.35; 32 -1.75,2.35 | smd 3.2 x 3.2: TH 0,0
SOT23-6 = smd 0.55 x 1.35: 1 -0.95,-1.375; 2 0,-1.375; 3 0.95,-1.375; 4 0.95,1.375; 5 0,1.375; 6 -0.95,1.375
1X02_NO_SILK = drill 1.016 pad 1.88: 1 0,0; 2 2.54,0
1X04_NO_SILK_ALL_ROUND = drill 1.016 pad 1.88: 1 0,0; 2 2.54,0; 3 5.08,0; 4 7.62,0
1X03_SMT = smd 1 x 2.5: 1 -2.54,1.52; 2 0,-1.52; 3 2.54,1.52
1X04_SMT = smd 1 x 2.5: 1 -3.81,1.52; 2 -1.27,-1.52; 3 1.27,1.52; 4 3.81,-1.52
LED3535 = smd 1 x 0.85: 1 -1.75,0.875; 2 -1.75,-0.875; 3 1.75,-0.875; 4 1.75,0.875
1X02_1.27MM_NO_SILK = drill 0.6: 9 0,0; 10 1.27,0
R0603 = smd 1 x 1.1: 1 -0.85,0; 2 0.85,0
EVUFXK = drill 1.1 pad 1.676: 1 -2.5,-7; 2 0,-7; 3 2.5,-7 | hole 2: 0,3.5; 0,-4
CTS742C083 = smd 0.5 x 0.9: 1 -1.2,-0.8; 2 -0.4,-0.8; 3 0.4,-0.8; 4 1.2,-0.8; 5 1.2,0.8; 6 0.4,0.8; 7 -0.4,0.8; 8 -1.2,0.8
BUTTONPAD-2X2-SINGLE = drill 0.6: SIG1 5.542,15.64; SIG2 8.082,13.608; SIG3 30.542,15.513; SIG4 33.082,13.481; SIG5 5.388,40.513; SIG6 7.928,38.481; SIG7 30.542,40.513; SIG8 33.082,38.481 | hole 3: 12.5,25; 25,37.5; 37.5,25; 25,12.5; 2.5,2.5; 2.5,47.5; 47.5,47.5; 47.5,2.5
SHORT_TOP_8MIL = smd 0.203 x 0.203: P$1 0,0; P$2 0,0
06P = drill 0.914 long: 1 -6.35,0; 2 -3.81,0; 3 -1.27,0; 4 1.27,0; 5 3.81,0; 6 6.35,0
1X06-1.27MM_POGO = drill 0.6 long: 1 0,0; 2 1.27,0; 3 2.54,0; 4 3.81,0; 5 5.08,0; 6 6.35,0
52745-0690 = smd 0.3 x 0.8: 1 -1.25,2.5; 2 -0.75,2.5; 3 -0.25,2.5; 4 0.25,2.5; 5 0.75,2.5; 6 1.25,2.5
POGOPROG-CONN-OH-SMALLERVIAS = drill 0.381: 1 0,2.54; 6 0,-3.81 | smd 0.889 x 0.813: 2 0,1.27; 3 0,0; 4 0,-1.27; 5 0,-2.54

### Placement (x,y rotation side)
C1  88.9,6.15 216 top
C2  82.83,3.45 192 top
C3  76.22,3.45 168 top
C4  70.71,4.95 234 top
C5  63.12,9.75 270 top
C6  63.11,17.34 96 top
C7  64.38,24.17 72 top
C8  67.66,29.76 48 top
C9  71.34,35.16 24 top
C10  79.53,35.58 0 top
C11  86.06,33.75 336 top
C12  91.39,29.76 312 top
C13  94.87,24 288 top
C14  95.39,17.42 264 top
C15  95.4,9.47 240 top
C16  25.4,18.87 90 bottom
C17  29.08,21.06 180 bottom
C18  4.72,30.38 180 bottom
C19  5.94,26.04 0 bottom
C20  18.16,76.07 180 bottom
C21  34.06,74.35 0 bottom
C22  18.44,51.26 180 bottom
C23  23.47,28.83 0 bottom
C24  34.11,49.28 0 bottom
C25  23.37,20.83 270 bottom
C26  26.09,21.39 0 bottom
C41  91.33,60.46 84 top
C42  89.99,57.52 162 top
C43  81.69,48.3 192 top
C44  78.25,47.51 192 top
C45  74.02,47.87 348 top
C46  69.32,49.65 324 top
C47  60.91,56.61 198 top
C48  63.31,63.25 174 top
C49  64.96,65.85 252 top
C50  66.36,71.57 228 top
C51  74.22,76.14 294 top
C52  77.91,76.26 180 top
C53  81.83,75.17 156 top
C54  88.62,70.01 312 top
C55  90.71,66.34 108 top
CN1  1.57,23.98 180 bottom
D1  19.48,0.84 0 bottom
ENC1  18.01,12.6 180 bottom
IC1  23.47,25.12 270 bottom
IC2  27.86,17.91 0 bottom
J1  71.98,33.27 156 bottom
J2  94.16,11.78 300 bottom
J3  63.2,14.55 240 bottom
J4  4.22,9.04 240 bottom
J5  10.49,26.92 156 bottom
J6  32.64,5.56 300 bottom
J7  63.12,58.24 240 bottom
J10  1.68,8.31 240 bottom
J11  30.1,6.32 300 bottom
J12  89.03,55.5 300 bottom
J13  70.18,73.56 156 bottom
J14  11.25,24.38 156 bottom
JP1  26.16,55.55 0 bottom
JP2  26.14,70.05 0 bottom
JP5  14.22,55.7 240 bottom
LED1  76.89,6.65 78 top
LED2  72.06,8.8 54 top
LED3  68.53,12.72 30 top
LED4  66.9,17.74 6 top
LED5  67.45,22.99 342 top
LED6  70.09,27.57 318 top
LED7  74.36,30.67 294 top
LED8  79.53,31.77 270 top
LED9  84.69,30.67 246 top
LED10  88.97,27.57 222 top
LED11  91.61,22.99 198 top
LED12  92.16,17.74 174 top
LED13  90.53,12.72 150 top
LED14  86.99,8.8 126 top
LED15  82.17,6.65 102 top
LED16  13.79,50.52 180 top
LED17  38.81,50.16 0 top
LED18  13.59,75.21 180 top
LED19  38.79,75.23 0 top
LED31  73.34,44.54 258 top
LED32  66.59,47.54 234 top
LED33  61.64,53.04 210 top
LED34  59.36,60.07 186 top
LED35  60.13,67.42 162 top
LED36  63.83,73.82 138 top
LED37  69.81,78.17 114 top
LED38  77.04,79.71 90 top
LED39  84.27,78.17 66 top
LED40  90.25,73.82 42 top
LED41  93.95,67.42 18 top
LED42  94.72,60.07 354 top
LED43  92.44,53.04 330 top
LED44  87.49,47.54 306 top
LED45  80.74,44.54 282 top
POWER  8.97,28.96 0 bottom
R1  85.83,5.04 114 top
R2  79.53,3.58 90 top
R3  73.1,4.62 66 top
R4  69.07,6.15 234 top
R5  66.85,4.63 144 top
R6  64.12,20.69 354 top
R7  65.86,27.02 330 top
R8  70.31,31.74 306 top
R9  76.38,34.25 282 top
R10  82.75,34.23 258 top
R11  88.38,31.22 234 top
R12  93.01,26.84 210 top
R13  94.94,20.69 186 top
R14  92.46,15.1 174 top
R15  89.77,9.82 138 top
R16  25.4,15.85 90 bottom
R17  8.71,30.38 180 bottom
R18  32.59,27.53 180 top
R19  32.59,29.59 180 top
R20  33.4,23.34 270 top
R21  9.73,16.84 180 bottom
R22  8.79,11.05 270 bottom
R23  28.4,1.32 180 bottom
R24  29.31,9.58 90 bottom
R25  18.01,12.62 0 bottom
R26  13.59,75.21 0 bottom
R27  18.03,3.76 180 bottom
R28  21.06,3.76 0 bottom
R29  38.79,75.23 180 bottom
R30  13.79,50.52 180 bottom
R31  38.81,50.16 180 bottom
R32  9.53,78.26 180 bottom
R33  30.61,76.07 270 bottom
R34  7.59,48.31 180 bottom
R35  29.51,51.03 270 bottom
R36  10.49,1.35 180 bottom
R37  13.49,1.35 0 bottom
R38  32.08,8.15 0 bottom
R39  28.17,6.58 90 bottom
R40  22.48,1.12 0 bottom
R41  66.59,76.31 126 top
R42  73.34,79.32 102 top
R43  80.74,79.32 78 top
R44  87.49,76.31 54 top
R45  92.44,70.82 30 top
R46  94.72,63.79 6 top
R47  93.95,56.43 342 top
R48  90.25,50.03 318 top
R49  84.27,45.68 294 top
R50  77.04,44.15 270 top
R51  69.81,45.68 246 top
R52  63.83,50.03 222 top
R53  58.16,55.66 108 top
R54  59.36,63.79 174 top
R55  61.64,70.82 150 top
RN1  24.43,4.14 90 bottom
RN2  5.94,21.95 180 bottom
RN3  7.54,21.95 180 bottom
RN4  12.98,4.09 90 bottom
S1  1.27,37.74 0 top
SH1  3.63,23.55 0 top
SH2  3.3,27.76 0 top
SL1  47.47,6.25 180 top
SL2  50.77,25.27 270 top
U$1  50.7,2.51 180 top
X1  4.93,14.92 90 bottom
X2  33.15,24.23 270 bottom
X3  32.33,14.06 270 bottom
X4  34.57,26.24 0 top
X5  43.69,25.07 270 top

### Tracks (layer width: path | path; a pad name or v marks a point on that pad's centre or on a via)
!RESET  (via drill 0.15, 0.15 pad 0.15)
  Top 0.203: X4.1 34.47,28.68 28.95,28.68 27.99,29.64 20.02,29.65 18.95,28.59 17.93,28.58 17.52,28.58 | 17.52,28.58 17.2,28.58 17.2,25.2 v17.53,24.87 | v6.73,30.38 15.14,30.38 16.94,28.58 16.97,28.58 17.52,28.58
  Bottom 0.203: C18.2 v6.73,30.38 R17.1 | v17.53,24.87 18.52,24.87 19,25.35 19.64,25.35 19.74,25.25 20.57,25.25 20.69,25.37 IC1.29
!SS  (1 unrouted)
  Top 0.203: SL2.4 49.96,24.82 X5.4
  Bottom 0.203: IC1.14 26.55,24.37 26.66,24.48 X2.3
AREF
  Bottom 0.203: C25.1 23.37,22.05 23.72,22.4 IC1.20
DTR
  Bottom 0.203: C18.1 1.63,30.38 CN1.6
ENC1A  (via drill 0.15)  (1 unrouted)
  Top 0.203: v11.25,20.95 11.25,21.89 11.68,22.33 15.06,22.33 15.49,22.76 17.86,22.76 18.14,22.48 v19.18,22.48 19.18,22.69 19.05,22.81 19.05,23.22 20.14,24.31 20.14,25.96 19.99,26.11 19.99,26.59 20.32,26.92 v20.5,26.92
  Bottom 0.203: ENC1.B 20.51,20.44 19.18,21.77 v19.18,22.48 | 4.74,21.09 4.75,21.1 RN2.8 4.74,21.43 5.21,21.9 7.7,21.9 7.94,21.66 RN3.6 7.94,20.26 8.38,19.82 9.71,19.82 9.86,19.82 | v11.25,20.95 10.12,19.82 9.86,19.82 | 9.86,19.82 | IC1.32 20.55,26.87 v20.5,26.92
  Bottom 0.406: S1.SIG7 R33.1 29.95,76.92 28.68,75.65 JP2.1
ENC1B  (via drill 0.15, 0.35)  (1 unrouted)
  Top 0.203: v5.54,20.24 8.64,20.24 v8.74,20.34
  Top 0.406: v17.14,66.04 8.69,66.04 v8.61,66.12
  Bottom 0.203: RN2.7 v5.54,20.24 | RN3.5 v8.74,20.35 v8.74,20.34 9.34,20.34 10.44,21.44 11.54,21.44 12.6,20.37 15.24,20.37 ENC1.A 15.6,20.19 15.6,21.04 15.8,21.24 15.8,23.86 17.37,25.43 18.3,25.43 20.34,27.47 IC1.1
  Bottom 0.406: R32.1 S1.SIG5 6.66,67.23 7.77,66.12 v8.61,66.12 | JP2.3 22.68,71.57 v17.14,66.04
ENC_SW  (1 unrouted)
  Bottom 0.203: R28.1 21.91,4.2 ENC1.E
  Bottom 0.406: R35.1 30.89,53.26 S1.SIG3 28.7,56.37 JP1.1
ENCL1A  (via drill 0.15)
  Top 0.203: 10.29,21.95 10.29,20.2 7.26,17.18 7.26,15.37 7.26,13.34 v7.44,13.16 7.44,11.94 7.19,11.68 7.19,10.79 v9.27,8.71 | 10.29,21.95 v9.25,21.95 | 10.29,21.95 11.38,23.04 14.76,23.04 15.19,23.47 16.1,23.47 v16.38,23.75
  Bottom 0.203: v9.25,21.95 8.16,21.95 7.94,22.16 RN3.3 | X1.1 7.43,13.17 v7.44,13.16 | RN4.2 11.2,3.69 9.14,5.74 9.14,8.59 v9.27,8.71 | v16.38,23.75 16.71,24.08 18.13,24.08 18.34,23.87 IC1.26
ENCL1B  (via drill 0.15)
  Top 0.203: v9.73,21.41 9.73,20.14 6.74,17.16 6.74,14.23 v6.73,14.17 6.73,10.57 9.07,8.23 9.6,8.23 v9.63,8.2
  Bottom 0.203: IC1.2 22.23,27.57 22.23,27.88 22.03,28.07 20.44,28.07 18.42,26.05 18.15,25.78 17.22,25.78 13.45,22 9.73,22 | RN3.4 9.53,22.75 9.73,22.55 9.73,22 | 9.73,22 v9.73,21.41 | X1.2 6.88,14.17 6.76,14.17 | RN4.3 10.89,4.5 9.63,5.76 v9.63,8.2
  Bottom 0.406: 6.76,14.17 v6.73,14.17
ENCL2A  (via drill 0.15, 0.15 pad 0.15)
  Top 0.203: v16.64,21.33 16.62,21.31 16.62,17.6 15.99,16.97 9.78,16.97 9.04,16.23 9.04,15.62 | 9.04,15.62 9.93,15.62 10.54,16.23 14.66,16.23 15.42,16.23 16.28,15.37 16.28,8.33 v17.53,7.09 18.31,7.09 19.41,5.99 19.41,4.83 19.96,4.27 v22.8,4.27 | v18.31,22.99 19.79,24.46 19.79,25.63 v19.58,25.83 | 9.04,15.62 v9.04,15.16 | v5.59,15.11 5.59,15.12 3.25,17.46 3.25,21.38 3.63,21.77 3.63,22.78 3.63,22.89 SH1.P$1
  Bottom 0.203: v16.64,21.33 16.77,21.46 16.77,21.54 18.22,22.99 v18.31,22.99 | v22.8,4.27 23.32,3.74 RN1.2 | v9.04,15.16 8.94,15.06 8.06,15.06 7.96,15.16 X1.4 5.65,15.17 v5.59,15.11 | R37.1 14.49,1.5 16.6,1.5 17.09,2 17.09,2.4 16.33,3.16 16.33,4.51 16.63,4.81 16.63,6.19 v17.53,7.09 | v19.58,25.83 19.62,25.87 20.23,25.87 20.27,25.83 20.67,25.83 20.71,25.87 IC1.30
ENCL2B  (via drill 0.15, 0.15 pad 0.15)
  Top 0.203: 16.64,17.1 16.12,16.59 10.2,16.59 v9.74,16.1 v9.73,16.1 | 16.64,17.1 16.99,17.45 16.99,20.95 17.25,21.21 v17.25,21.34 | 16.64,17.1 16.64,11.95 22.82,5.76 v22.82,4.95 | v19.53,23.01 19.53,23.19 20.5,24.16 20.5,26.29 v20.47,26.31 | v6.15,15.67 5.54,15.67 3.76,17.45 3.76,20.21 6.15,22.6 6.15,26.49 4.88,27.76 SH2.P$1
  Bottom 0.152: v6.15,15.67
  Bottom 0.203: v9.73,16.1 9.72,16.1 9.44,15.82 9.02,15.82 8.87,15.67 8.86,15.67 8.61,15.42 8.21,15.42 7.95,15.67 X1.5 v6.15,15.67 | v17.25,21.34 17.35,21.34 19.02,23.01 v19.53,23.01 | v22.82,4.95 23.23,4.54 23.23,4.55 RN1.3 24.18,4.54 24.53,4.18 24.53,2.58 24.68,2.44 26.44,2.44 27.64,3.63 27.64,5.2 R39.1 | IC1.31 20.53,26.37 v20.47,26.31
ENCR1A  (via drill 0.15)
  Top 0.203: v30.5,12.68 31.36,12.68 32.84,14.16 32.84,21.34 32.33,21.84 32.33,21.85 29.57,24.62 29.57,26.19 26.63,29.13 26.62,29.13 v26.59,29.16 26.47,29.29 20.15,29.29 18.91,28.04 v18.7,28.04 v18.69,28.04
  Bottom 0.203: RN1.7 25.77,3.73 26.31,4.28 26.31,9.45 27.23,10.37 27.23,12.06 27.97,12.81 X3.6 30.35,12.81 30.36,12.8 30.38,12.8 v30.5,12.68 | v26.59,29.16 25.53,29.16 25.15,28.78 25.15,28.22 24.72,27.82 IC1.7 | RN2.1 4.74,23.18 5.74,24.18 9.76,24.18 10.84,23.09 13,23.09 17.95,28.04 v18.69,28.04
ENCR1B  (via drill 0.15)
  Top 0.203: v30.56,13.28 31.46,13.28 32.49,14.31 32.49,21.18 31.98,21.69 31.98,21.7 29.21,24.47 29.21,26.05 26.58,28.68 v26.21,28.68 25.96,28.93 25.83,28.93 20.3,28.93 18.8,27.43 v18.62,27.43
  Bottom 0.203: RN1.6 25.56,4.54 25.96,4.94 25.96,9.6 26.87,10.52 26.87,12.22 27.87,13.21 29.74,13.21 X3.5 29.86,13.28 v30.56,13.28 | IC1.8 25.22,27.76 26.14,28.68 v26.21,28.68 | RN2.2 5.54,23.21 6.16,23.82 9.61,23.82 10.7,22.74 13.15,22.74 17.84,27.43 v18.62,27.43
ENCR2A  (via drill 0.15, 0.15 pad 0.15)
  Top 0.203: v27.18,25.45 27.25,25.45 28.14,24.56 28.14,23.98 31.42,20.71 31.42,15.24 v31.01,14.83 30.86,14.68 28.9,14.68 28.55,14.34 28.55,11.17 29.11,10.61 29.11,8.16 22.65,1.7 16.1,1.7 v15.82,1.98
  Bottom 0.203: v27.18,25.45 27.16,25.47 26.28,25.47 26.18,25.37 IC1.12 | X3.3 30.51,14.31 31.01,14.81 v31.01,14.83 | v15.82,1.98 15.82,2.06 14.19,3.69 RN4.7 13.2,3.69 12.98,3.47 12.98,2.42 12.72,2.16 10.45,2.16 R36.1
ENCR2B  (via drill 0.15, 0.15 pad 0.15)
  Top 0.203: v26.47,24.97 27.23,24.97 27.79,24.41 27.79,23.84 31.04,20.58 31.04,15.57 v30.94,15.47 30.5,15.04 28.75,15.04 28.63,14.92 28.54,14.83 28.32,14.6 28.19,14.48 28.19,11.02 28.75,10.46 28.75,8.31 26.39,5.95 26.39,5.94 22.5,2.06 19.91,2.06 19.79,2.18 v19.53,2.18 19.28,2.18 19.15,2.06 16.61,2.06 v16.46,2.21
  Bottom 0.152: D1.- 19.53,1.65 v19.53,2.18
  Bottom 0.203: IC1.13 26.37,24.87 v26.47,24.97 | v16.46,2.21 16.44,2.21 14.16,4.49 RN4.6 | X3.2 29.85,14.83 30.26,14.83 30.9,15.47 v30.94,15.47 31.55,15.47 33.64,13.38 33.64,10.15 32.93,9.45 R38.1
GND  (via drill 0.15, 0.2, 0.35, 0.71)  (6 unrouted)
  Top 0.203: 35.62,27.75 35.62,29.81 35.64,29.82 | SL1.5 43.66,5.61 45.59,3.68 45.59,2.72 | 45.59,2.72 v45.59,2.52 | U$1.5 45.62,2.69 45.59,2.72
  Bottom 0.203: 22.82,28.63 C23.2 22.72,28.73 IC1.3 22.72,26.93 v23.49,26.16 23.72,26.39 IC1.5 | IC2.6 28.81,19.43 29.11,19.43 v29.59,18.95 | IC1.21 23.22,23.84 v23.49,24.11
  Bottom 0.406: J4.4 7.29,1.71 J10.4 | J5.2 12.81,26.63 12.66,26.48 | 12.66,26.48 12.32,26.14 | J14.2 12.66,26.33 12.66,26.48
  other vias: 71.88,11.87 75.67,9.6 79.89,8.77 83.97,9.85 89.46,16.1 89.74,20.51 88.31,24.47 85.44,27.68 77.08,29.25 73.12,27.32 70.35,24.21 69.14,19.82 8,24.77 29.64,11.56 12.55,19.79 9.68,17.63 11.28,5.03 11.56,10.34 64.23,17.48 63.52,25.36 79.47,34.45 92.81,32.19 91.13,3.87 82.27,1.94 69.8,15.65 87.32,12.25 81.41,29.22 27.89,29.06 27.74,15.34 24.66,6.5 11.58,19.28 12.45,21.31 14.27,19.76 27.84,17.91 22.38,19.35 15.32,21.44 6.73,6.1 17.86,29.11 35.59,19.48 35.69,23.75 30.4,26.04 22.49,24.11 24.49,24.11 22.49,25.13 23.49,25.13 24.49,25.13 22.49,26.16 24.49,26.16 57.81,66.08 57.78,57.96 61.12,50.44 67.07,45.06 74.84,42.4 83.07,43.25 90.12,47.34 94.91,53.83 96.69,61.77 94.98,69.76 90.21,76.39 83.21,80.57 74.91,81.53 67.27,79.03 61.17,73.55 63.27,65.13 66.63,62.64 70.37,53.82 70.92,48.51 75.98,47.56 80.56,49.45 91.53,62.54 79.9,75.96 71.33,70.79 85.53,67.98 82.12,52.8 68.62,55.82 4.09,10.57 8.86,27.46 5.49,8.33 31.72,30.84 1.17,9.88 1.47,15.75 29.41,29.16 66.99,32.94 89.99,68.37 67.94,73.77 64.93,70 87.27,34.45 81.63,35.95 11.02,14.83 24.82,10.06 26.42,15.39 24.28,21.41 4.24,19.18 32.79,3.28 33.76,19.96 31.8,25.76 32.16,22.99 28.5,21.95 54.76,1.32 54.79,12.47 40.28,12.5 40.26,1.32 40.23,32.41 57.12,32.38 57.25,17.83 40.18,17.86 30.56,20.07 22.61,30.2 21.16,30.78 10.46,30.89 0.86,29.06 3.73,21.18 3.63,24.82 7.67,11.48 24.59,30.53 22.33,2.77 96.52,14.36 75.16,1.43 60.6,55.13 63.27,51.06 96.21,30.08 96.04,8.08 89.57,59.03 65.02,14.76 46.16,82.12 6.82,82.12 6.56,43.46 45.75,42.88 29.34,53.98 41.76,51.05 10.87,49.63 10.69,74.35 41.66,76.1 26.11,66.6 23.6,59.03 8.43,57.02 12.62,66.93 18.59,2.62 26.29,0.71 26.62,3.38 31.14,7.16 31.65,12.04 24.49,19.58 17.42,2.77 15.24,0.97 16.36,21.92 16.99,23.6
  pour Top: 99.09,89.03 0,89.03 0,0 99.09,0 99.09,36.75
  pour Bottom: 99.09,89.03 0,89.03 0,0 99.09,0
LED1  (via drill 0.15, 0.35)  (5 unrouted)
  Top 0.203: v10.77,15.75 10.77,15.72 10.31,15.27 9.83,15.27 9.22,14.65 9.22,9.45 10.11,8.56 10.11,8 v8.28,6.17 | v10.59,17.73 10.41,17.91 10.21,17.91 9.93,18.19 9.93,18.59 10.64,19.3 10.64,21.8 11.53,22.68 14.91,22.68 15.34,23.11 17.2,23.11 17.53,23.44 17.53,23.72 17.65,23.85 17.65,24.18 18.09,24.61 18.09,25.15 17.6,25.63 17.6,26.62 17.94,26.95 18.82,26.95 20.44,28.57 25.52,28.57 26.01,28.07 v26.29,28.07
  Top 0.406: R3.1 v74.4,4.09 74.68,4.87 LED1.1 | R50.1 v75.79,45.54 LED31.1 | LED16.1 v16.54,49.66
  Bottom 0.203: v10.59,17.73 10.59,17.37 R21.2 10.77,16.65 v10.77,15.75 | v8.28,6.17 7.65,5.54 | 7.65,5.54 J4.3 6.02,3.91 J10.3 | RN4.1 10.34,2.89 7.7,5.54 7.65,5.54 | IC1.9 25.82,27.6 v26.29,28.07
  Bottom 0.406: 65.73,10.38 J3.3 65.79,10.2 70.39,10.2 74.69,5.87 v74.4,4.09 | J7.3 72.87,50.22 v75.79,45.54 | JP5.3 13.3,53.6 | JP5.3 13.49,53.84 | v16.54,49.66 R30.2 JP5.3
LED2  (via drill 0.15)
  Top 0.203: v26.64,27.03 27.69,27.03 28.85,25.88 28.85,24.3 32.13,21.02 32.13,14.46 31.49,13.82 v30.86,13.82 | v26.14,2.92 26.14,2.91 24.02,0.79 16.1,0.79 14.71,2.18 v14.71,2.49
  Bottom 0.152: v30.86,13.82 30.86,13.8
  Bottom 0.203: IC1.10 26.14,26.37 26.44,26.68 26.44,26.82 v26.64,27.03 | X3.4 30.85,13.81 v30.86,13.82 | 30.86,13.8 31.04,13.63 31.04,12.51 30.72,12.19 28.09,12.19 27.58,11.68 27.58,10.22 26.67,9.31 26.67,4.13 26.14,3.6 v26.14,2.92 | RN1.8 26.12,2.94 v26.14,2.92 | 26.15,2.94 v26.14,2.92 | RN4.8 14.18,2.49 v14.71,2.49
LED_OUT  (via drill 0.15, 0.35)  (6 unrouted)
  Top 0.203: v22.84,3.15 22.71,3.27 10.9,3.27 v9.86,4.32
  Top 0.406: R49.2 v81.28,44.35 LED45.3 | R2.2 v79.53,5.71 82.19,7.34 LED15.3 | LED17.3 v41.54,49.29 v41.55,49.28
  Bottom 0.203: v9.86,4.32 8.79,5.38 8.79,8.69 | v9.86,4.32 | J10.2 4.75,6.11 J4.2 6.94,6.84 8.79,8.69 | R22.2 8.79,8.69 | v22.84,3.15 23.04,2.94 RN1.1
  Bottom 0.406: v79.53,5.71 75.71,5.71 70.66,10.76 64.59,12.35 J3.2 | J7.2 66.47,54.97 66.51,54.95 66.52,54.94 67.54,53.52 67.74,53.42 73.18,50.72 73.19,50.72 73.22,50.71 73.24,50.68 73.33,50.61 73.33,50.6 v81.28,44.35 | v41.55,49.28 R31.2 39.66,48.48 38.41,47.22 25.25,47.22 19.16,53.31 19.16,53.88 18.44,54.6 17.86,54.6 JP5.2
LEDL  (via drill 0.15)
  Top 0.203: v8.41,15.9 8.38,15.88 8.38,14.48 8.74,14.12 v8.74,13.97
  Bottom 0.203: X1.3 8.2,14.67 8.74,14.13 v8.74,13.97 8.74,11.95 R22.1 | R21.1 8.88,16.45 8.41,15.98 v8.41,15.9
MISO  (via drill 0.15, 0.71)  (2 unrouted)
  Top 0.203: R19.1 34.73,29.6 35.27,29.07 35.27,27 34.57,26.3 X4.3 33.98,26.24 32.08,24.34 v32.08,24.31 | U$1.3 48.16,3.68 48.74,4.27 SL1.3 | SL2.2 47.51,25.82 X5.2
  Bottom 0.203: IC1.16 26.56,23.37 26.94,23.75 29.8,23.75 30.07,23.48 X2.5 30.66,23.5 31.27,23.5 v32.08,24.31
  other vias: 48.16,2.51
MOSI  (via drill 0.15, 0.71)  (3 unrouted)
  Top 0.203: v31.98,24.92 33.44,26.38 R18.1 33.46,27.51 X4.2 | v49.43,2.49 49.43,3.63 51.28,5.49 SL1.2 | SL2.3 49.55,25.32 X5.3
  Bottom 0.203: IC1.15 26.55,23.87 26.79,24.11 29.95,24.11 30.07,23.98 30.9,23.98 30.89,23.98 X2.4 31.07,23.98 31.98,24.89 v31.98,24.92
N$1
  Top 0.4: R13.1 LED11.1
  Top 0.406: LED10.3 R12.2 92.28,25.05 92.01,24.78 92.01,23.91 92.5,23.43 92.82,23.43 LED11.1
N$2
  Top 0.4: LED12.1 93.81,17.18 93.08,17.91 93.08,18.97 94.09,19.98 R13.2 LED11.3
  Top 0.406: LED12.1 93.81,15.51 R14.1
N$3
  Top 0.406: LED38.1 R42.1 69.98,80.09 | 69.98,80.09 LED37.3 | R41.2 69.2,78.02 69.98,80.09
N$4
  Top 0.406: LED39.1 81.74,77.65 R43.1 LED38.3 76.81,80.67 76.74,80.6 76.71,80.6 76.18,80.23 R42.2
N$5
  Top 0.406: 68.57,5.17 R4.2 | R4.2 R5.1 | R4.2 68.57,6.48 68.46,6.6 68.46,7.26 | LED2.3 73.03,8.92 70.12,8.92 68.46,7.26 | LED3.1 67.09,12.09 67.83,12.09 68.48,11.44 68.48,10.81 68.46,10.79 68.46,7.26
N$6
  Top 0.406: LED13.3 89.76,12.01 R15.2 87.35,8.48 LED14.1 | 87.31,6.66 LED14.1 | LED14.1 R1.1
N$7
  Bottom 0.203: C16.1 R16.2 25.57,16.53 IC2.3
N$8
  Top 0.406: LED40.1 R44.1 LED39.3 83.59,78.84 R43.2
N$9
  Top 0.406: R15.1 90.4,9.89 LED13.1 91.6,12.18 91.45,12.33 91.45,15.08 | R14.2 91.45,15.08 | LED12.3 91.45,17.85 91.45,15.08
N$10
  Top 0.4: LED8.3 R10.2 83.63,32.33 83.63,32.19 84.2,31.62 84.95,31.62 85.25,31.91 LED9.1 R11.1
N$11  (via drill 0.35)
  Top 0.4: R6.1 LED4.1 65.06,18.32 66.16,17.23
  Top 0.406: v67.17,6.2 66.16,5.18 R5.2 | v69.16,9.49 LED3.3 69.97,13.35 69.23,13.35 68.58,14 68.58,14.8 66.16,17.23
  Bottom 0.406: v67.17,6.2 68.39,7.42 68.39,8.9 v69.16,9.49
N$12
  Top 0.406: 81.56,4.75 R2.1 | LED15.1 81.56,4.75 | 81.56,4.75 81.57,4.75 82.89,6.07 83.86,6.07 84.11,5.82 R1.2 LED14.3
N$13  (via drill 0.35)
  Top 0.406: LED16.3 v11.1,51.41 | LED18.1 16.37,74.33 v16.38,74.32
  Bottom 0.406: R30.1 v11.1,51.41 6.68,55.83 6.68,62.15 16.38,71.86 v16.38,74.32 R26.1
N$14
  Top 0.406: LED1.3 R3.2 72.75,6.09 72.75,7.17 72.03,7.89 LED2.1 69.44,7.01 R4.1
N$15
  Bottom 0.203: C16.2 26.47,19.72 IC2.4
N$16
  Top 0.406: LED43.1 R47.1 LED42.3 95.17,60.23 R46.2
N$17
  Top 0.4: LED5.1 66.39,24.37 66.7,24.05 66.7,21.49 65.61,20.4 65.45,20.4 68.73,17.11 LED4.3
  Top 0.406: LED5.1 R7.1 | 65.61,20.4 R6.2
N$18
  Top 0.406: LED5.3 R7.2 67.08,27.08 68.44,27.08 69.22,27.86 69.22,29.24 LED6.1 R8.1
N$19
  Top 0.406: LED6.3 R8.2 72.35,31.06 72.51,30.9 73.26,30.9 73.83,31.47 73.83,32.01 LED7.1 74.79,33.1 75.32,33.34 75.71,34.34 75.71,34.58 R9.1
N$20
  Top 0.406: LED44.1 R48.1 LED43.3 93.09,53.09 R47.2
N$21
  Top 0.406: R48.2 88.4,47.7 LED44.3 R49.1 LED45.1
N$22
  Top 0.4: LED10.1 90.56,28.38 89.44,28.38 88.67,29.16 88.67,29.75 R11.2 86.88,30.54 83.2,29.43 LED9.3
  Top 0.406: R12.1 LED10.1
N$23
  Top 0.406: R51.2 66.7,46.9 LED32.3 R52.1 LED33.1
N$24
  Top 0.406: R52.2 61.6,52.54 LED33.3 R53.1 58.72,55.05 59.11,56.91 60.91,58.08 LED34.1
N$25
  Top 0.406: LED35.1 R54.1 59.96,63.44 LED34.3 59.11,59.5 58.45,57.86 58.38,57.55 58.08,57.35 R53.2
N$26
  Top 0.406: LED36.1 R55.1 LED35.3 59.83,67.57 R54.2
N$27
  Top 0.406: R10.1 LED8.1 80.08,33.52 79.22,32.66 78.08,32.66 77.33,33.42 R9.2 74.4,28.84 LED7.3
N$28
  Top 0.406: LED32.1 70.08,46.55 R51.1 LED31.3 73.43,43.78 73.67,43.92 73.82,43.89 R50.2
N$29
  Top 0.406: LED41.1 R45.1 LED40.3 90.18,74.47 88.84,76.02 R44.2
N$30
  Top 0.406: R45.2 94.35,67.74 LED41.3 R46.1 LED42.1
N$31
  Bottom 0.152: R40.2 21.35,0.84 D1.+
N$43  (via drill 0.35)
  Top 0.406: v37.06,52.5 LED17.1 v36.09,51.03 | v40.54,72.97 LED19.3 v41.48,74.35
  Bottom 0.406: v37.06,52.5 37.06,58.27 40.73,61.93 40.73,72.78 v40.54,72.96 v40.54,72.97 | v41.48,74.35 R29.2 | v36.09,51.03 R31.1
N$44  (via drill 0.35)
  Top 0.406: LED19.1 v36.07,76.12 | LED18.3 10.81,76.08 v10.79,76.1
  Bottom 0.406: R29.1 v36.07,76.12 36.07,76.91 33.22,79.76 15.93,79.76 12.74,76.57 R26.2 v10.79,76.1
N$46
  Top 0.406: R55.2 63.49,73.81 LED36.3 R41.1 LED37.1
PAD
  Bottom 0.406: R16.1 25.4,13.72
POT  (via drill 0.35)  (1 unrouted)
  Top 0.406: v23.55,51.49 23.55,48.46 v22.4,47.32
  Bottom 0.203: R25.2 18.01,4.58 R27.1 18.09,2.86 18.09,1.57 16.99,0.48 13.11,0.48 12.64,0.95 R37.2 R36.2
  Bottom 0.406: 25.91,54.03 JP1.2 23.62,51.49 v23.55,51.49 | 6.78,53.35 S1.SIG1 6.81,48.38 R34.1 6.75,47.38 7.8,46.33 21.41,46.33 v22.4,47.32 | 6.77,53.37 6.78,53.35 | 6.83,53.3 6.78,53.35
POT+
  Bottom 0.152: R25.1 21.18,4.95 21.18,3.12 22.14,2.15 24.16,2.15 24.99,1.32 R23.1
  Bottom 0.203: 20.7,5.43 R25.1
RST  (via drill 0.71)  (1 unrouted)
  Top 0.203: v50.7,2.49 53.82,5.61 SL1.1
RXD
  Top 0.203: CN1.4 2.39,25.25 3.63,24 SH1.P$2
SCK  (via drill 0.15, 0.71)  (2 unrouted)
  Top 0.203: v32.16,23.7 32.65,24.19 R20.1 34.18,24.97 X4.4 | U$1.4 46.89,3.66 46.2,4.34 SL1.4 | X5.1 47.15,26.32 48.41,27.58 48.41,29.26 SL2.1
  Bottom 0.203: IC1.17 25.23,22.78 26.47,22.78 27.08,23.39 29.64,23.39 30.05,22.99 30.39,22.99 X2.6 31.44,22.98 v32.16,23.7
  other vias: 46.89,2.51
SCL  (via drill 0.15, 0.15 pad 0.15)  (1 unrouted)
  Top 0.203: v27.61,26.42 27.58,26.44 26.53,26.44 25.11,27.85 20.73,27.85 19.1,26.22 19.1,25.64 19.15,25.59 19.15,25.02 v19.3,24.87 | SL2.5 47.92,24.32 X5.5
  Bottom 0.203: IC1.28 v19.31,24.87 v19.3,24.87 | v27.61,26.42 28.49,25.48 28.99,24.98 X2.2
SDA  (via drill 0.15)  (1 unrouted)
  Top 0.203: v26.95,27.58 25.99,27.58 25.37,28.21 20.58,28.21 18.75,26.37 18.75,25.5 18.8,25.45 18.8,24.51 v18.95,24.36 | X5.6 46.44,23.82 47.33,23.82 48.44,22.71 48.44,21.26 SL2.6
  Bottom 0.203: IC1.27 v18.96,24.37 v18.95,24.36 | X2.1 29.05,25.48 28.09,26.44 28.09,26.62 27.81,26.9 27.64,26.9 v26.95,27.58
SW1  (via drill 0.15, 0.15 pad 0.15, 0.3 pad 0.15)
  Top 0.203: v11.48,15.75 15.4,15.75 15.9,15.24 15.9,7.1 16.92,6.09 16.92,5.16 17.54,4.53 18.43,4.53 18.59,4.7 v18.92,4.7 19.84,3.79 23.72,3.79 28.19,8.26 v28.19,8.59 28.19,10.52 27.84,10.88 27.84,14.46 27.84,14.63 27.96,14.75 28.18,14.98 | v21.39,21.89 21.57,21.89 22.23,21.23 22.23,20.3 22.66,19.86 23.99,19.86 24.78,20.65 28.78,20.65 30.32,19.11 30.32,16.44 30.07,16.2 30.07,15.85 29.62,15.39 28.6,15.39 28.18,14.98 | 28.18,14.98
  Bottom 0.203: v11.48,15.75 11.48,18.06 10.06,19.47 8.23,19.47 7.14,20.55 RN3.7 | IC1.23 22.22,22.42 21.69,21.89 v21.39,21.89 | RN3.7 | R28.2 R27.2 18.88,4.66 v18.92,4.7 | R24.2 29.25,10.43 28.19,9.37 v28.19,8.59
SWL  (via drill 0.15)
  Top 0.203: v10.41,18.39 11,18.97 11,19.96 11.73,20.7 11.73,21.67 12.04,21.97 15.21,21.97 15.64,22.4 17.71,22.4 18.11,22 19.38,22 v19.91,22.53
  Bottom 0.203: 7.43,19.73 X1.6 | 7.43,19.73 6.34,20.81 | RN3.8 6.34,20.81 | 6.34,20.81 | RN3.8 | v10.41,18.39 9.69,19.11 8.04,19.11 7.43,19.73 | v19.91,22.53 21.25,22.53 21.49,22.77 IC1.24
SWR  (via drill 0.15)
  Top 0.203: 18.09,26.42 v18.09,26.42 18.09,25.65 18.44,25.3 18.44,24.46 18.01,24.03 v18.01,23.52 | v20.52,23.04 21.18,22.38 21.59,22.38 22.59,21.38 22.59,20.44 22.81,20.22 23.85,20.22 24.63,21.01 28.93,21.01 30.69,19.24 30.69,16.11 v30.56,15.98
  Bottom 0.203: v18.09,26.42 17.35,26.42 13.3,22.36 10.55,22.36 9.45,23.47 7.42,23.47 7.14,23.19 RN2.4 | RN2.4 RN2.3 | RN2.4 | RN2.3 | IC1.25 21.1,23.39 20.7,23.39 | 20.7,23.39 20.68,23.39 20.56,23.52 v18.01,23.52 | 20.7,23.39 20.52,23.22 v20.52,23.04 | X3.1 29.9,15.32 v30.56,15.98
TOUCH  (via drill 0.15, 0.3 pad 0.15)
  Top 0.203: v26.49,25.96 26.54,26.01 27.3,26.01 28.5,24.82 28.5,24.13 31.77,20.85 31.77,14.71 31.39,14.33 29.23,14.33 v29.03,14.12 29.03,11.2 29.67,10.57 v29.67,7.82
  Bottom 0.203: v29.03,14.12 28.8,14.35 IC2.1 | IC1.11 26.14,25.87 26.15,25.88 26.42,25.88 v26.49,25.96 | R38.2 30.9,7.82 v29.67,7.82 | R24.1 29.67,8.37 v29.67,7.82 | R39.2 28.56,7.82 v29.67,7.82
TXD
  Top 0.203: SH2.P$2 1.6,27.76 CN1.5
VCC  (via drill 0.3, 0.35, 0.71)  (4 unrouted)
  Top 0.203: 65.68,11.55 64.61,10.97 | SL1.6 41.12,5.74 U$1.6
  Top 0.4: v90.79,7.03 90.66,6.95 | C10.1 LED8.2
  Top 0.406: J14.1 11.25,26.16 J5.1 | 77.38,3.31 C3.1 | C41.1 92.47,59.47 LED42.2 | 89.35,72.02 LED40.2 C54.1 86.37,69.05 86.34,69.07 | 81.32,51.36 83.22,52.01 85.89,54.55 86.74,55.37 87.13,56.38 | 87.13,56.38 88.44,59.89 88.44,59.93 | 88.48,64.56 88.47,64.39 88.47,62.97 88.44,59.93 | 86.34,69.07 87.74,66.12 88.28,64.98 88.48,64.56 | 86.34,69.07 | 86.34,69.07 85.96,69.39 82.56,72.17 82.56,72.18 81.96,72.36 81.73,72.42 | 78.16,73.48 81.73,72.42 | 71.28,71.78 73.11,72.89 73.13,72.89 77.9,73.56 77.95,73.55 77.95,73.54 78.16,73.48 | 71.28,71.78 70.65,71.4 69.02,70.41 | 66.19,66.39 69.02,70.41 | 65.61,62.93 66.19,66.39 | 65.61,62.93 65.37,61.49 65.92,59.13 | 65.92,59.13 65.99,58.81 66.46,56.78 67.46,55.49 69.38,53 70.31,52.51 | 78.16,73.48 | LED39.2 C53.1 81.73,72.42 | C41.1 88.44,59.93 | LED45.2 C44.1 78.64,50.45 81.32,51.36 | LED44.2 84.14,48.16 C43.1 81.32,51.36 | 70.31,52.51 C46.1 68.02,50.58 LED32.2 | 66.19,66.39 C49.1 LED35.2 | LED36.2 C50.1 69.02,70.41 | LED41.2 C55.1 88.48,64.56 | LED31.2 72.84,46.45 C45.1 73.72,50.68 70.31,52.51 | LED38.2 78.76,76.66 C52.1 78.16,73.48 | 65.61,62.93 C48.1 | 91.39,59.37 C41.1 | v71.63,4.31 71.76,4.44 71.3,5.6 71.26,5.63 C4.1 71.56,6.04 71.56,6.69 LED2.2 | LED5.2 C7.1 v63.14,22.35 | LED6.2 C8.1 v66.22,29.84 | 77.38,3.31 LED1.2 | v78.03,2.51 77.38,3.31 | C2.1 83.39,3.58 | 95.49,18.4 C14.1 | LED9.2 C11.1 v84.28,34.56 | C14.1 LED12.2 | LED10.2 89.73,29.44 C12.1 v90.12,31.19 | LED11.2 C13.1 v94.26,25.93 | LED14.2 C1.1 v90.79,7.03 | C2.1 LED15.2 | 64.61,10.97 63.38,10.97 63.2,10.79 C5.1 62.71,12.59 J3.1 C6.1 LED4.2 | LED3.2 65.68,11.55 | C15.1 J2.1 LED13.2 | LED33.2 62.47,54.92 C47.1 J7.1 | C51.1 LED37.2 J13.1 71.28,71.78
  Top 0.406: LED43.2 J12.1 | J12.1 C42.1 | J12.1 87.13,56.38 | v95.68,19.35 C14.1 | C10.1 v77.57,35.55 | J7.1 65.92,59.13 | J7.1 62.01,59.75 61.98,60.04 61.75,60.23 61.01,60.97 LED34.2 | v84.81,3.81 C2.1 | C9.1 70.95,34.43 J1.1 72.85,31.95 LED7.2 | LED16.2 v16.48,51.44 | LED17.2 37.04,49.27 v36.02,49.28 | LED19.2 v35.99,74.35 | LED18.2 16.27,76.08 v16.28,76.1 14.1,78.28 v11.81,78.28
  Bottom 0.203: 26.94,22.15 C26.1 | 26.94,22.15 25.03,22.15 24.72,22.45 IC1.18 | 23.77,28.07 23.51,28.07 23.22,27.79 IC1.4 | 23.77,28.07 23.93,28.07 24.22,27.79 IC1.6 | 23.77,28.07 24.17,28.47 24.17,28.83 | 27.85,19.3 IC2.5 27.86,20.69 C17.1 28,21.31 | 15.29,29.74 15.21,29.67 | 30.02,22.49 34.51,22.49 X4.6 | 28,21.31 27.85,21.48 | 30.02,22.49 28.19,22.49 28,22.3 28,21.31 | 30.02,22.49 29.47,23.04 27.23,23.04 26.94,22.74 26.94,22.15 | 10.71,29.74 10.2,29.74 R17.2 | 29.25,1.55 R23.2 29.25,2.32 30.1,3.17 30.1,3.49 30.09,3.53 30.1,3.55 30.1,3.94 30.11,3.96 30.1,4 J11.1
  Bottom 0.4: 63.19,16.45 63.17,22.32
  Bottom 0.406: 24.17,28.83 C23.1 24.32,29.73 24.31,29.74 | 2.95,22.71 2.95,9.58 | J4.1 3.68,9.58 2.95,9.58 | 2.95,9.58 J10.1 | 2.95,9.58 | POWER.9 8.86,28.96 10.49,27.33 J5.1 | J11.1 31.88,6.33 J6.1 33.27,5.56 34.77,7.06 34.77,22.23 X4.6 34.57,26.37 31,26.37 28.83,28.55 28.83,29.03 28.12,29.74 24.31,29.74 | 2.95,22.71 CN1.3 | 2.95,22.71 2.95,25.09 C19.+ 3.89,27.67 4.27,28.05 8.07,28.05 8.61,28.58 8.61,28.6 POWER.9 | 63.17,22.32 v63.14,22.35 63.4,22.6 66.22,29.48 v66.22,29.84 68.86,33.19 71.18,34.49 71.2,34.5 | v90.79,7.03 90.74,7.03 | POWER.9 8.97,28.93 | POWER.9 9.92,28.96 10.71,29.74 15.29,29.74 21.32,29.74 22.36,30.79 23.27,30.79 24.31,29.74 | 90.74,7.03 94.36,8.48 J2.1 v95.68,19.35 v94.26,25.93 v90.12,31.19 v84.28,34.56 v77.57,35.55 73.33,35.68 71.22,34.51 71.2,34.5 | 90.74,7.03 v84.81,3.81 v78.03,2.51 74.3,3.25 v71.63,4.31 | J1.1 71.2,34.5 | J3.1 63.19,16.45 | C22.1 v16.48,51.44 15.26,52.66 15.26,54.56 14.53,55.28 13.96,55.28 JP5.1 | v36.02,49.28 C24.1 34.81,49.28 33.96,50.13 29.56,50.13 | v35.99,74.35 C21.1 | 29.56,50.13 R35.2 | C22.1 17.74,51.26 | JP5.1 11.56,58.8 14.32,58.8 14.9,59.38 19.06,59.38 22.98,55.46 25.34,55.46 25.52,55.63 26.81,55.63 28.23,54.22 28.23,50.84 28.94,50.13 29.56,50.13 | JP5.1 11.43,58.24 13.47,60.28 14.07,60.28 16.12,62.33 23.95,62.33 34.91,73.29 C21.1 | JP5.1 10.39,57.63 | v16.28,76.1 17.29,76.1 C20.1 17.31,75.44 17.91,74.84 17.91,70.92 11,64.01 JP5.1 | C21.1 34.76,74.35 33.91,75.2 30.63,75.2 R33.2 | v11.81,78.28 10.4,78.28 R32.2 | R34.2 16.71,48.31 17.63,49.23 17.59,49.26 C22.1
  other vias: 44.35,2.51

### Text on the board
Dimension: CUTOUT | CUTOUT
bPlace: L | R | R | S>T | M | RPT | L | LPT | BTN | R1 | POT | ESW | POT
tNames: SCK | MISO | MOSI | !SS | SCL | SDA | VCC | GND | SCK | MISO | MOSI | RST
Document: the height of an SK6812 is 1.6mm where / as the height for a smd encoder is ~4.5mm | Siirrä X3 ylemmäs? | use WS2812B or SK6812 to save on gpio pins | (0.1 -0.03) | GPIO needed: / I2C: 2 / SPI: 4 (+ interrupt?) / encoder: 2 / leds: 1 / = 5 - 7(/8) | (-0.1 -0.03) | (c> 2 1.9) | 0.5mm FFC max current = 0.55A / http://www.axon-cable.com/publications/FFC-Flat-Cables.pdf | F+M headerit päällekkäin on noin 5.1mm? | kooderin korkeus 4+(5-7 kierteet)mm | (0.03 0.1)